# EasyEDA Pro project ProPrj_OpenWear Module_2024-08-07.epro

# Schematic schematic1
Create Date: 2023-11-08; Page Name: P1; Project Name: OpenWear button; Schematic Name: schematic1; Update Date: 2023-11-08; Company: 嘉立创EDA; Page Size: A4; Version: V1.0
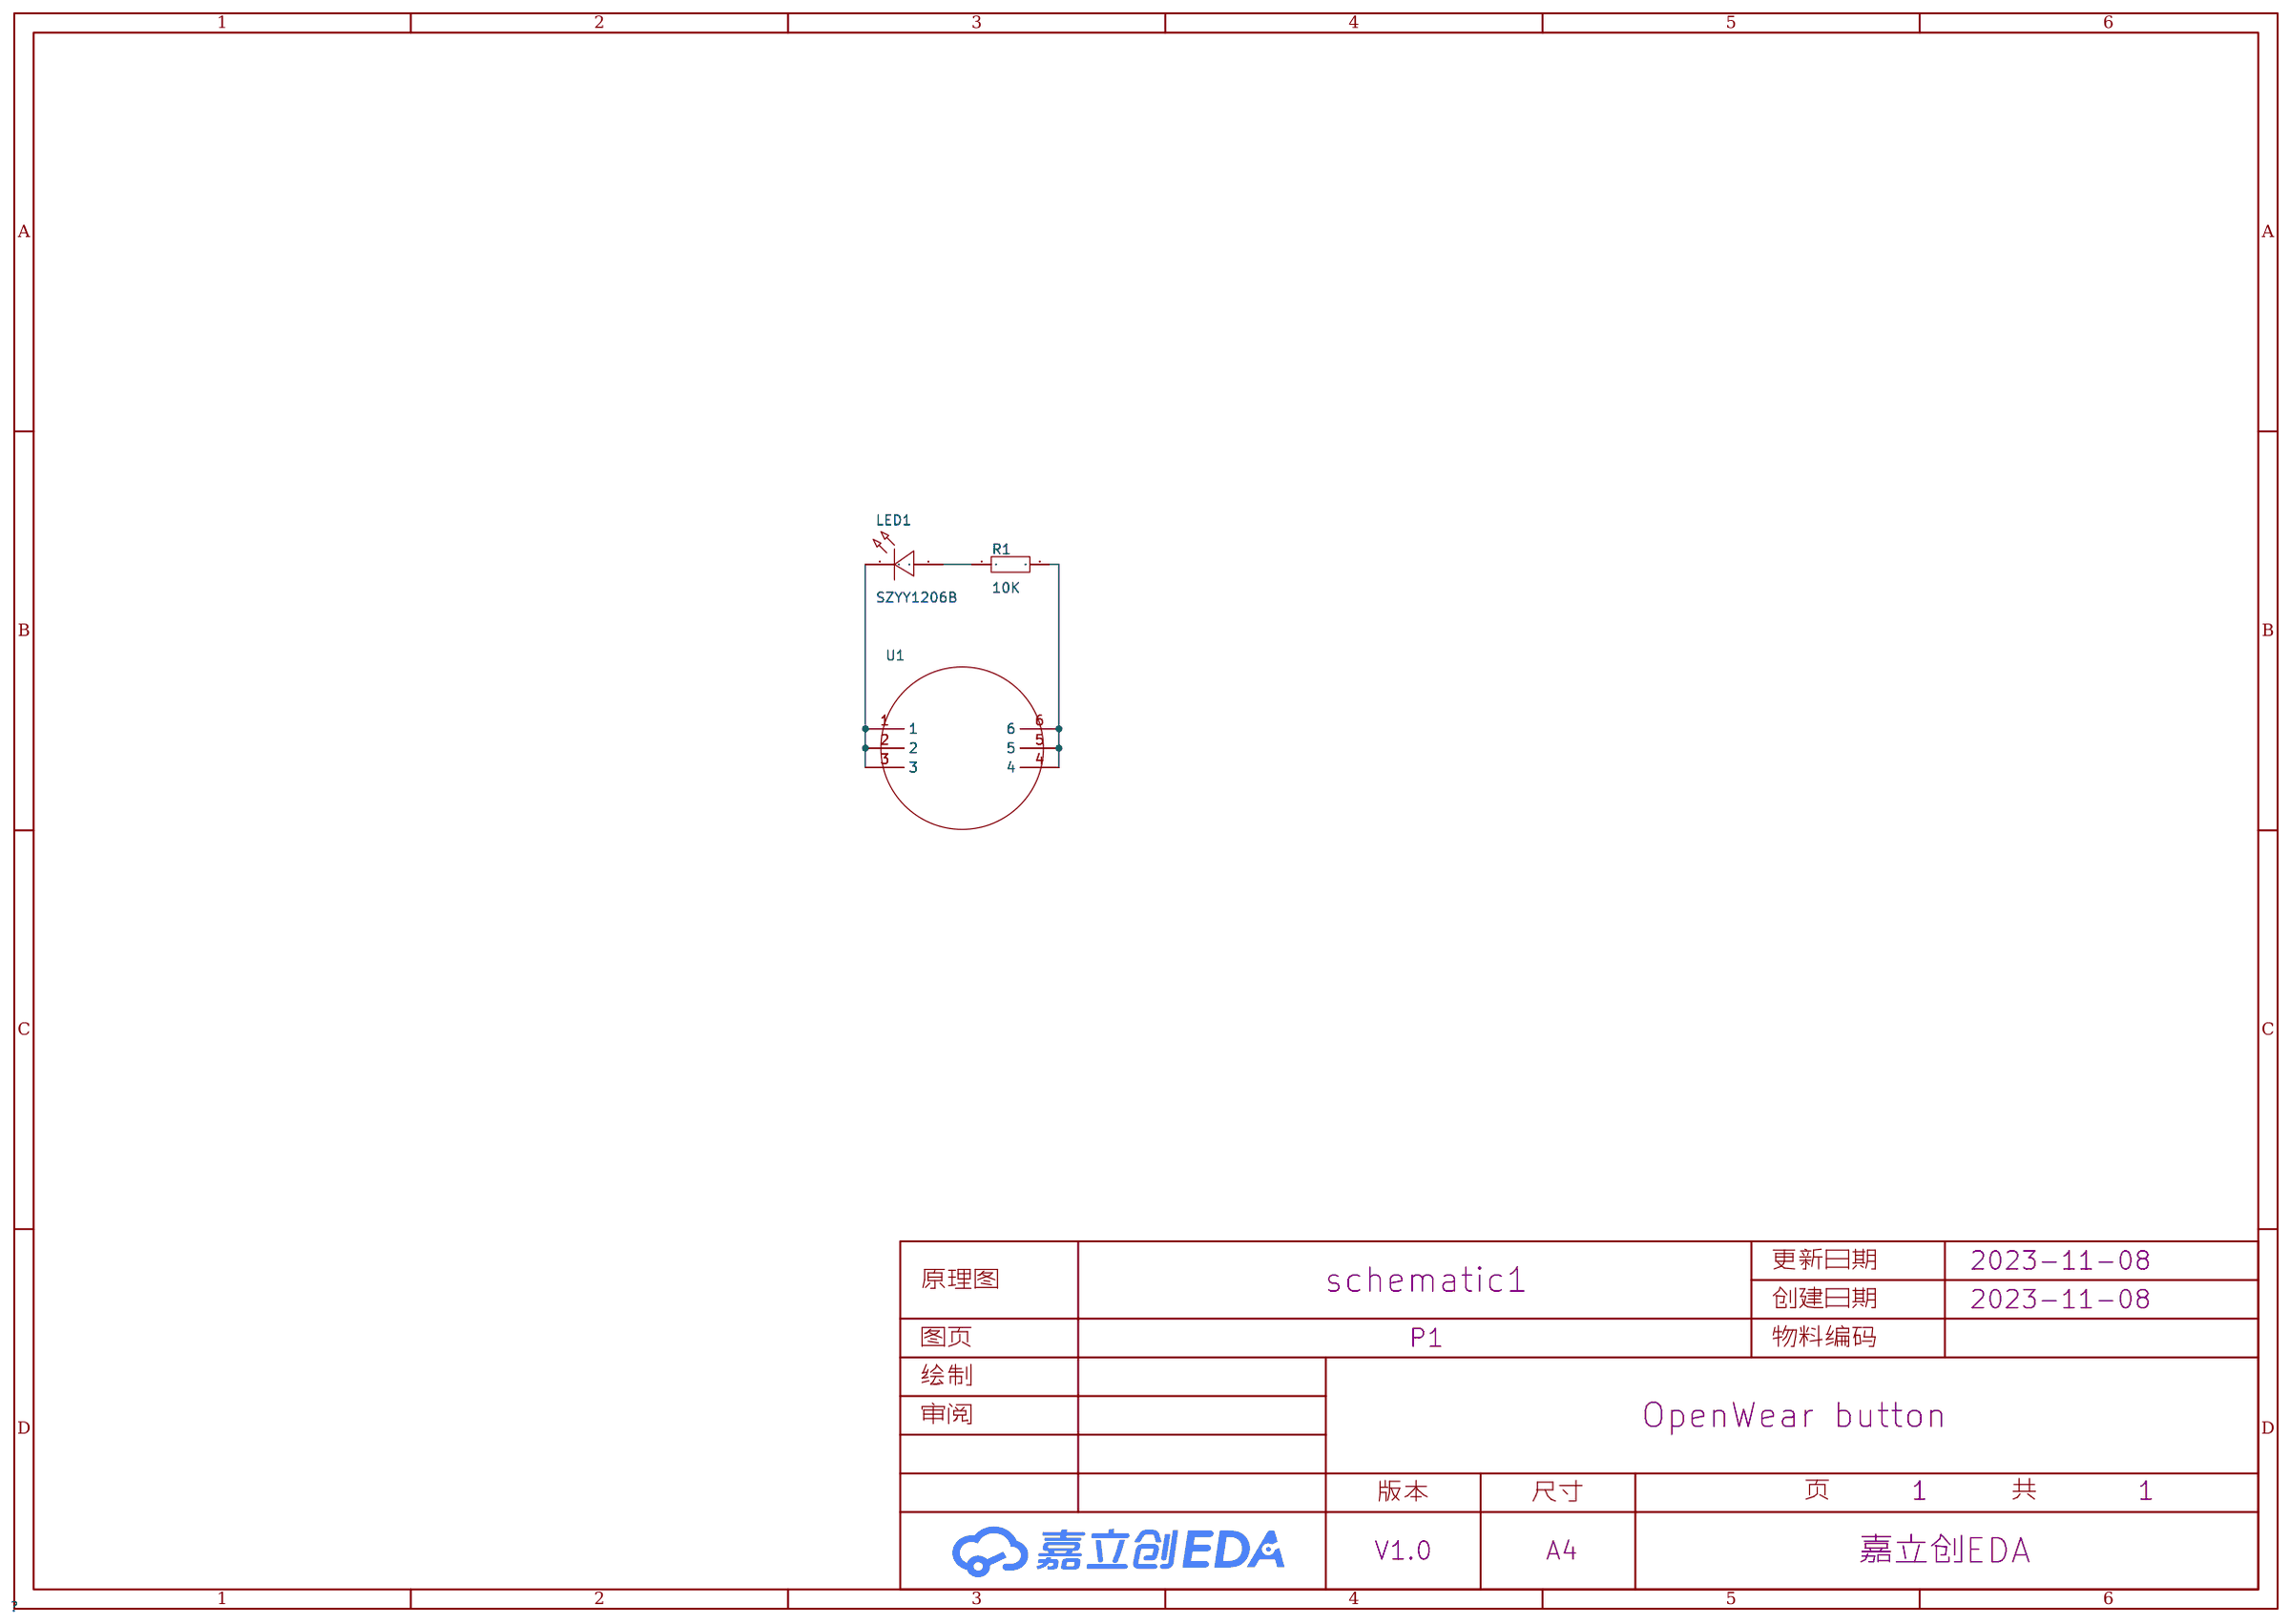
[diagram p0: schematic sheet]

## Parts
LED1  SZYY1206B  [LED1206-RD_BLUE]
R1  10K  [R0805]
U1  -  [ring-6]

## Library data of the parts
LED1 = SZYY1206B: 发光颜色:蓝灯;二极管配置:-;主波长:460nm~475nm;色温:-;功率:100mW;安装方式:-;; LCSC Part Name: 蓝灯; Supplier Part: C434440; Manufacturer: yongyu(永裕光电); Supplier Footprint: 1206; Datasheet: https://atta.szlcsc.com/upload/public/pdf/source/20200628/C434440_4695B106742D2A5A4116465A96970157.pdf; Supplier: LCSC; Emitted Color: 蓝灯; Lens Color: 无色透明; Dominant Wavelength: 460nm~475nm; Peak Wavelength: 469nm; Forward Current: 5mA; Power Dissipation: 100mW; Viewing Angle: 120°; Operating Temperature: -40℃~+85℃
R1 = Res_0805: Supplier Footprint: 0805
U1 = ring-6

## Nets
$1N188: LED1.2 R1.1
$1N621: LED1.1 U1.1 U1.2 U1.3
$1N631: R1.2 U1.4 U1.5 U1.6

# Schematic schematic1_2
Create Date: 2023-11-08; Page Name: P1; Project Name: OpenWear button; Schematic Name: schematic1_2; Update Date: 2023-11-08; Company: 嘉立创EDA; Page Size: A4; Version: V1.0
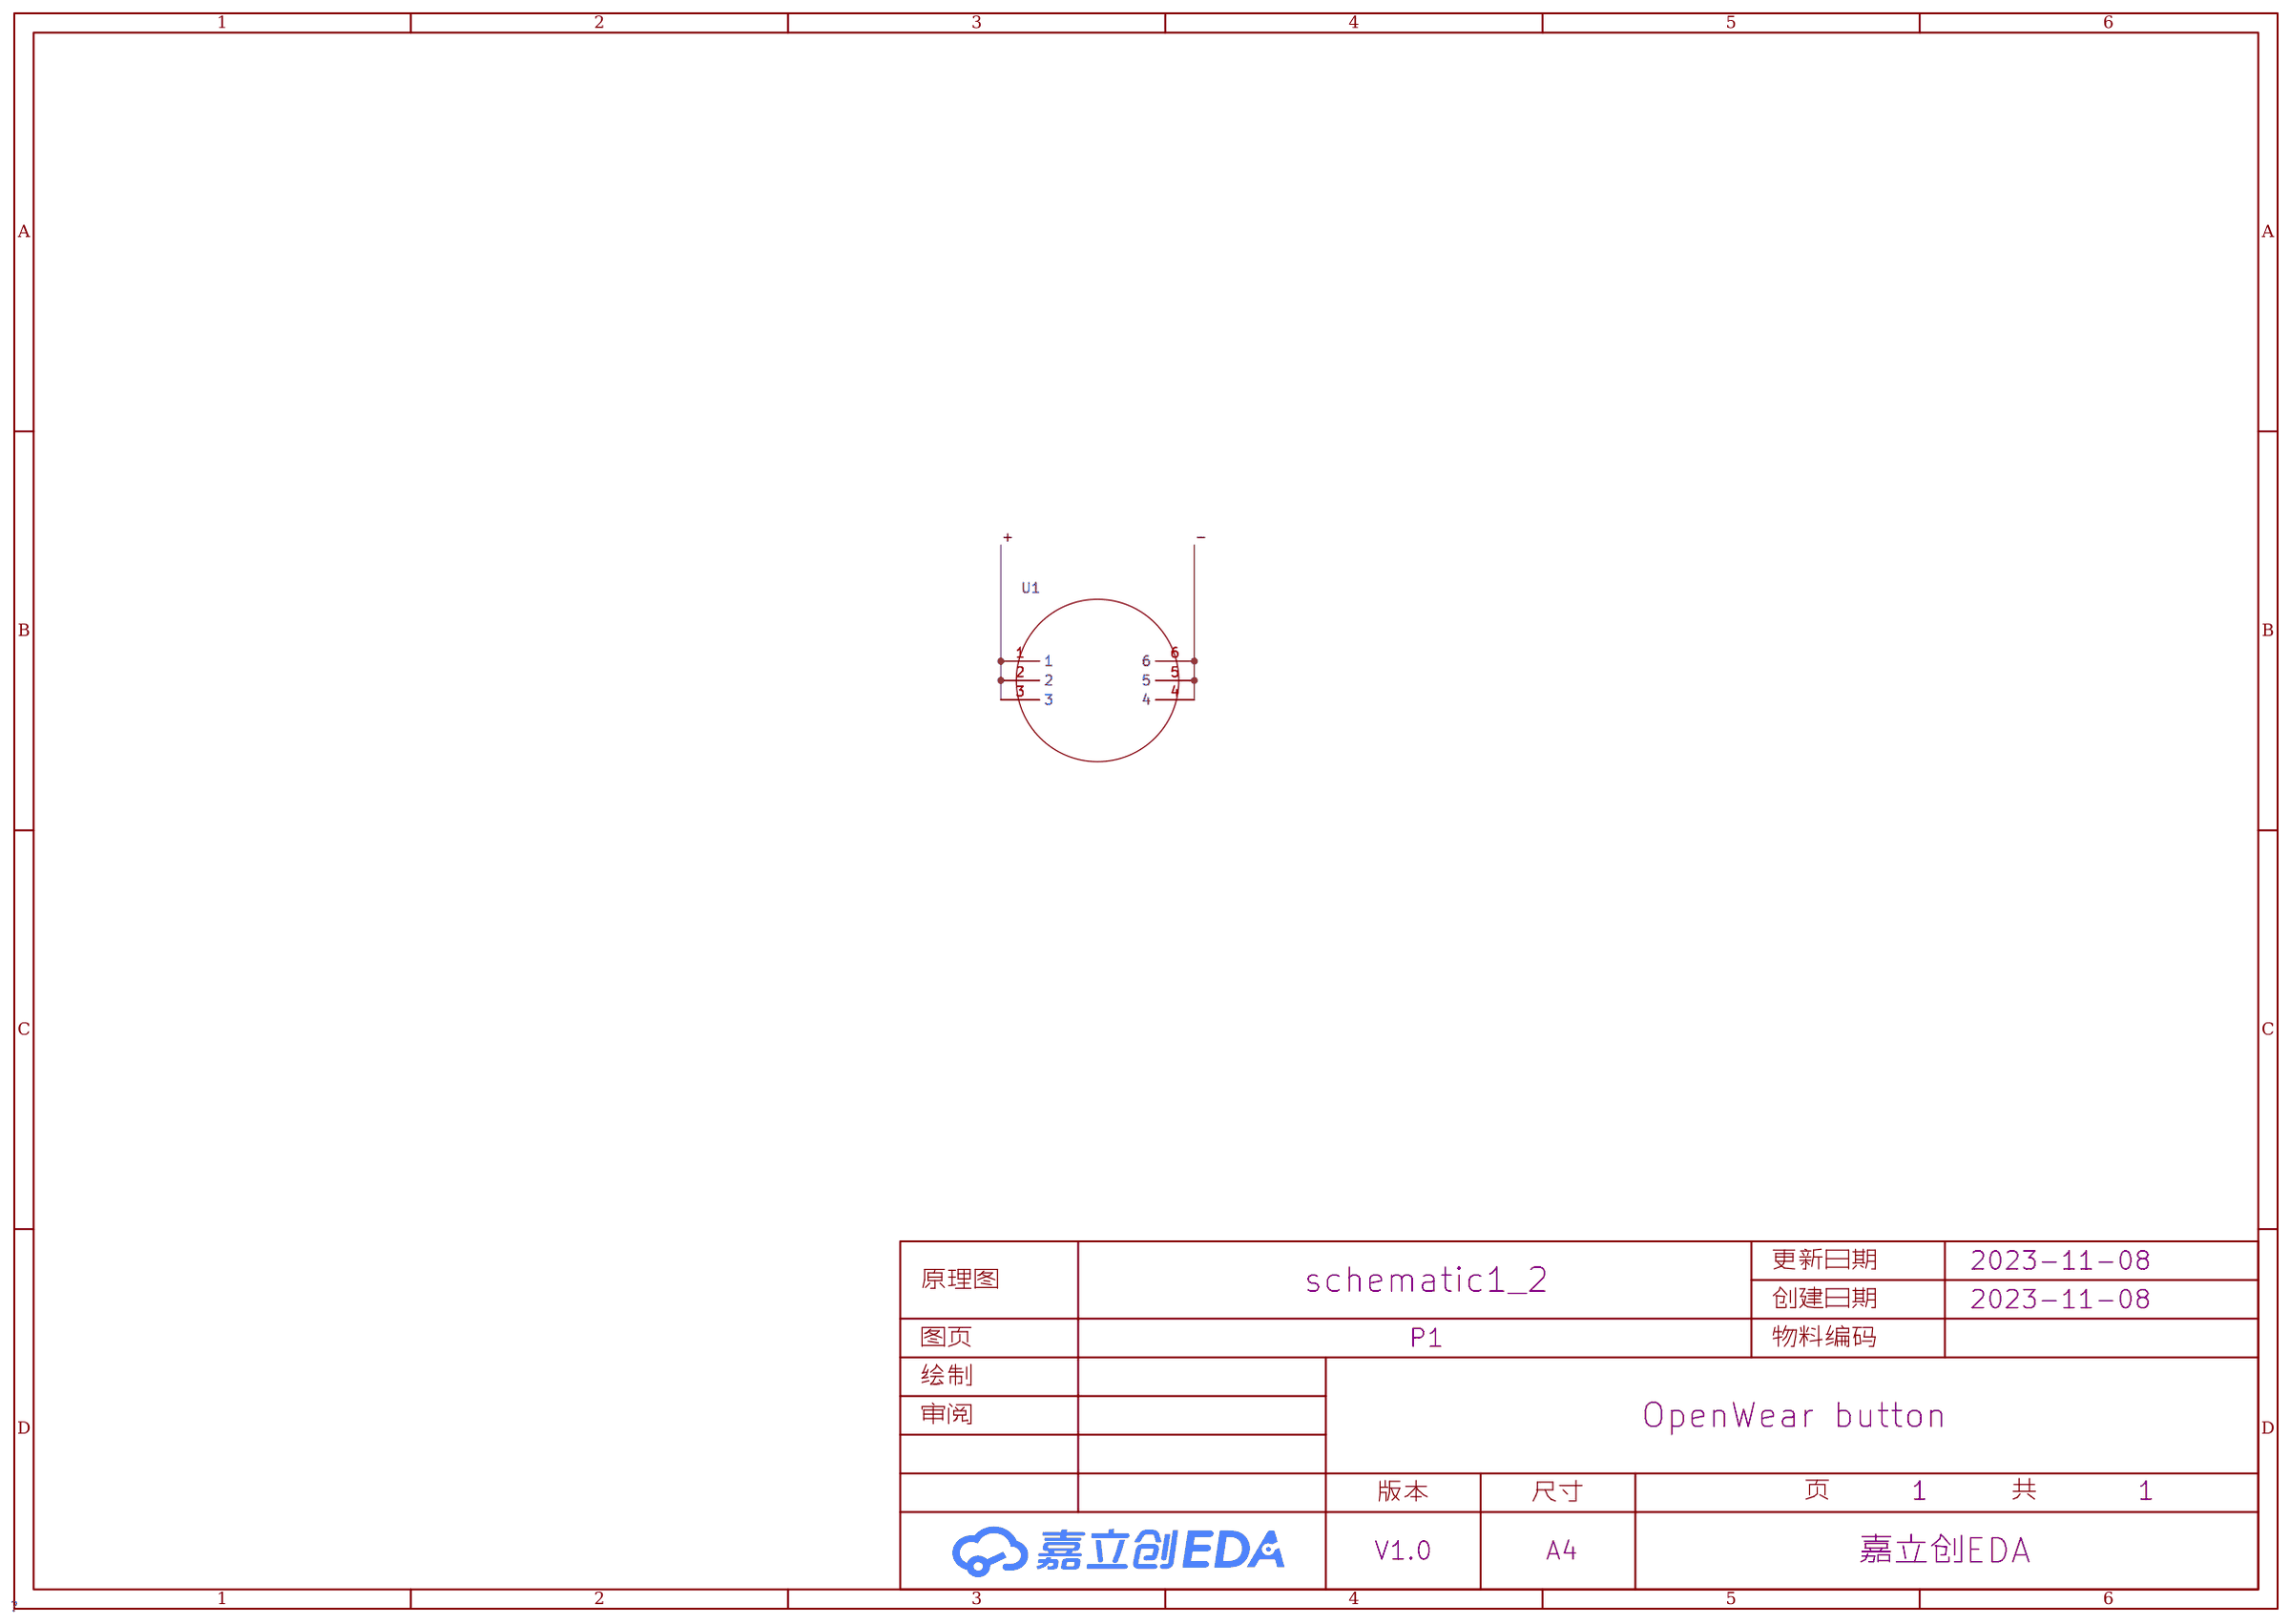
[diagram p1: schematic sheet]

## Parts
U1  -  [ring-6]

## Library data of the parts
U1 = ring-6

## Nets
+: U1.1 U1.2 U1.3
-: U1.4 U1.5 U1.6

# Schematic schematic1_3
Create Date: 2023-11-08; Page Name: P1; Project Name: OpenWear button; Schematic Name: schematic1_3; Update Date: 2023-11-08; Company: 嘉立创EDA; Page Size: A4; Version: V1.0
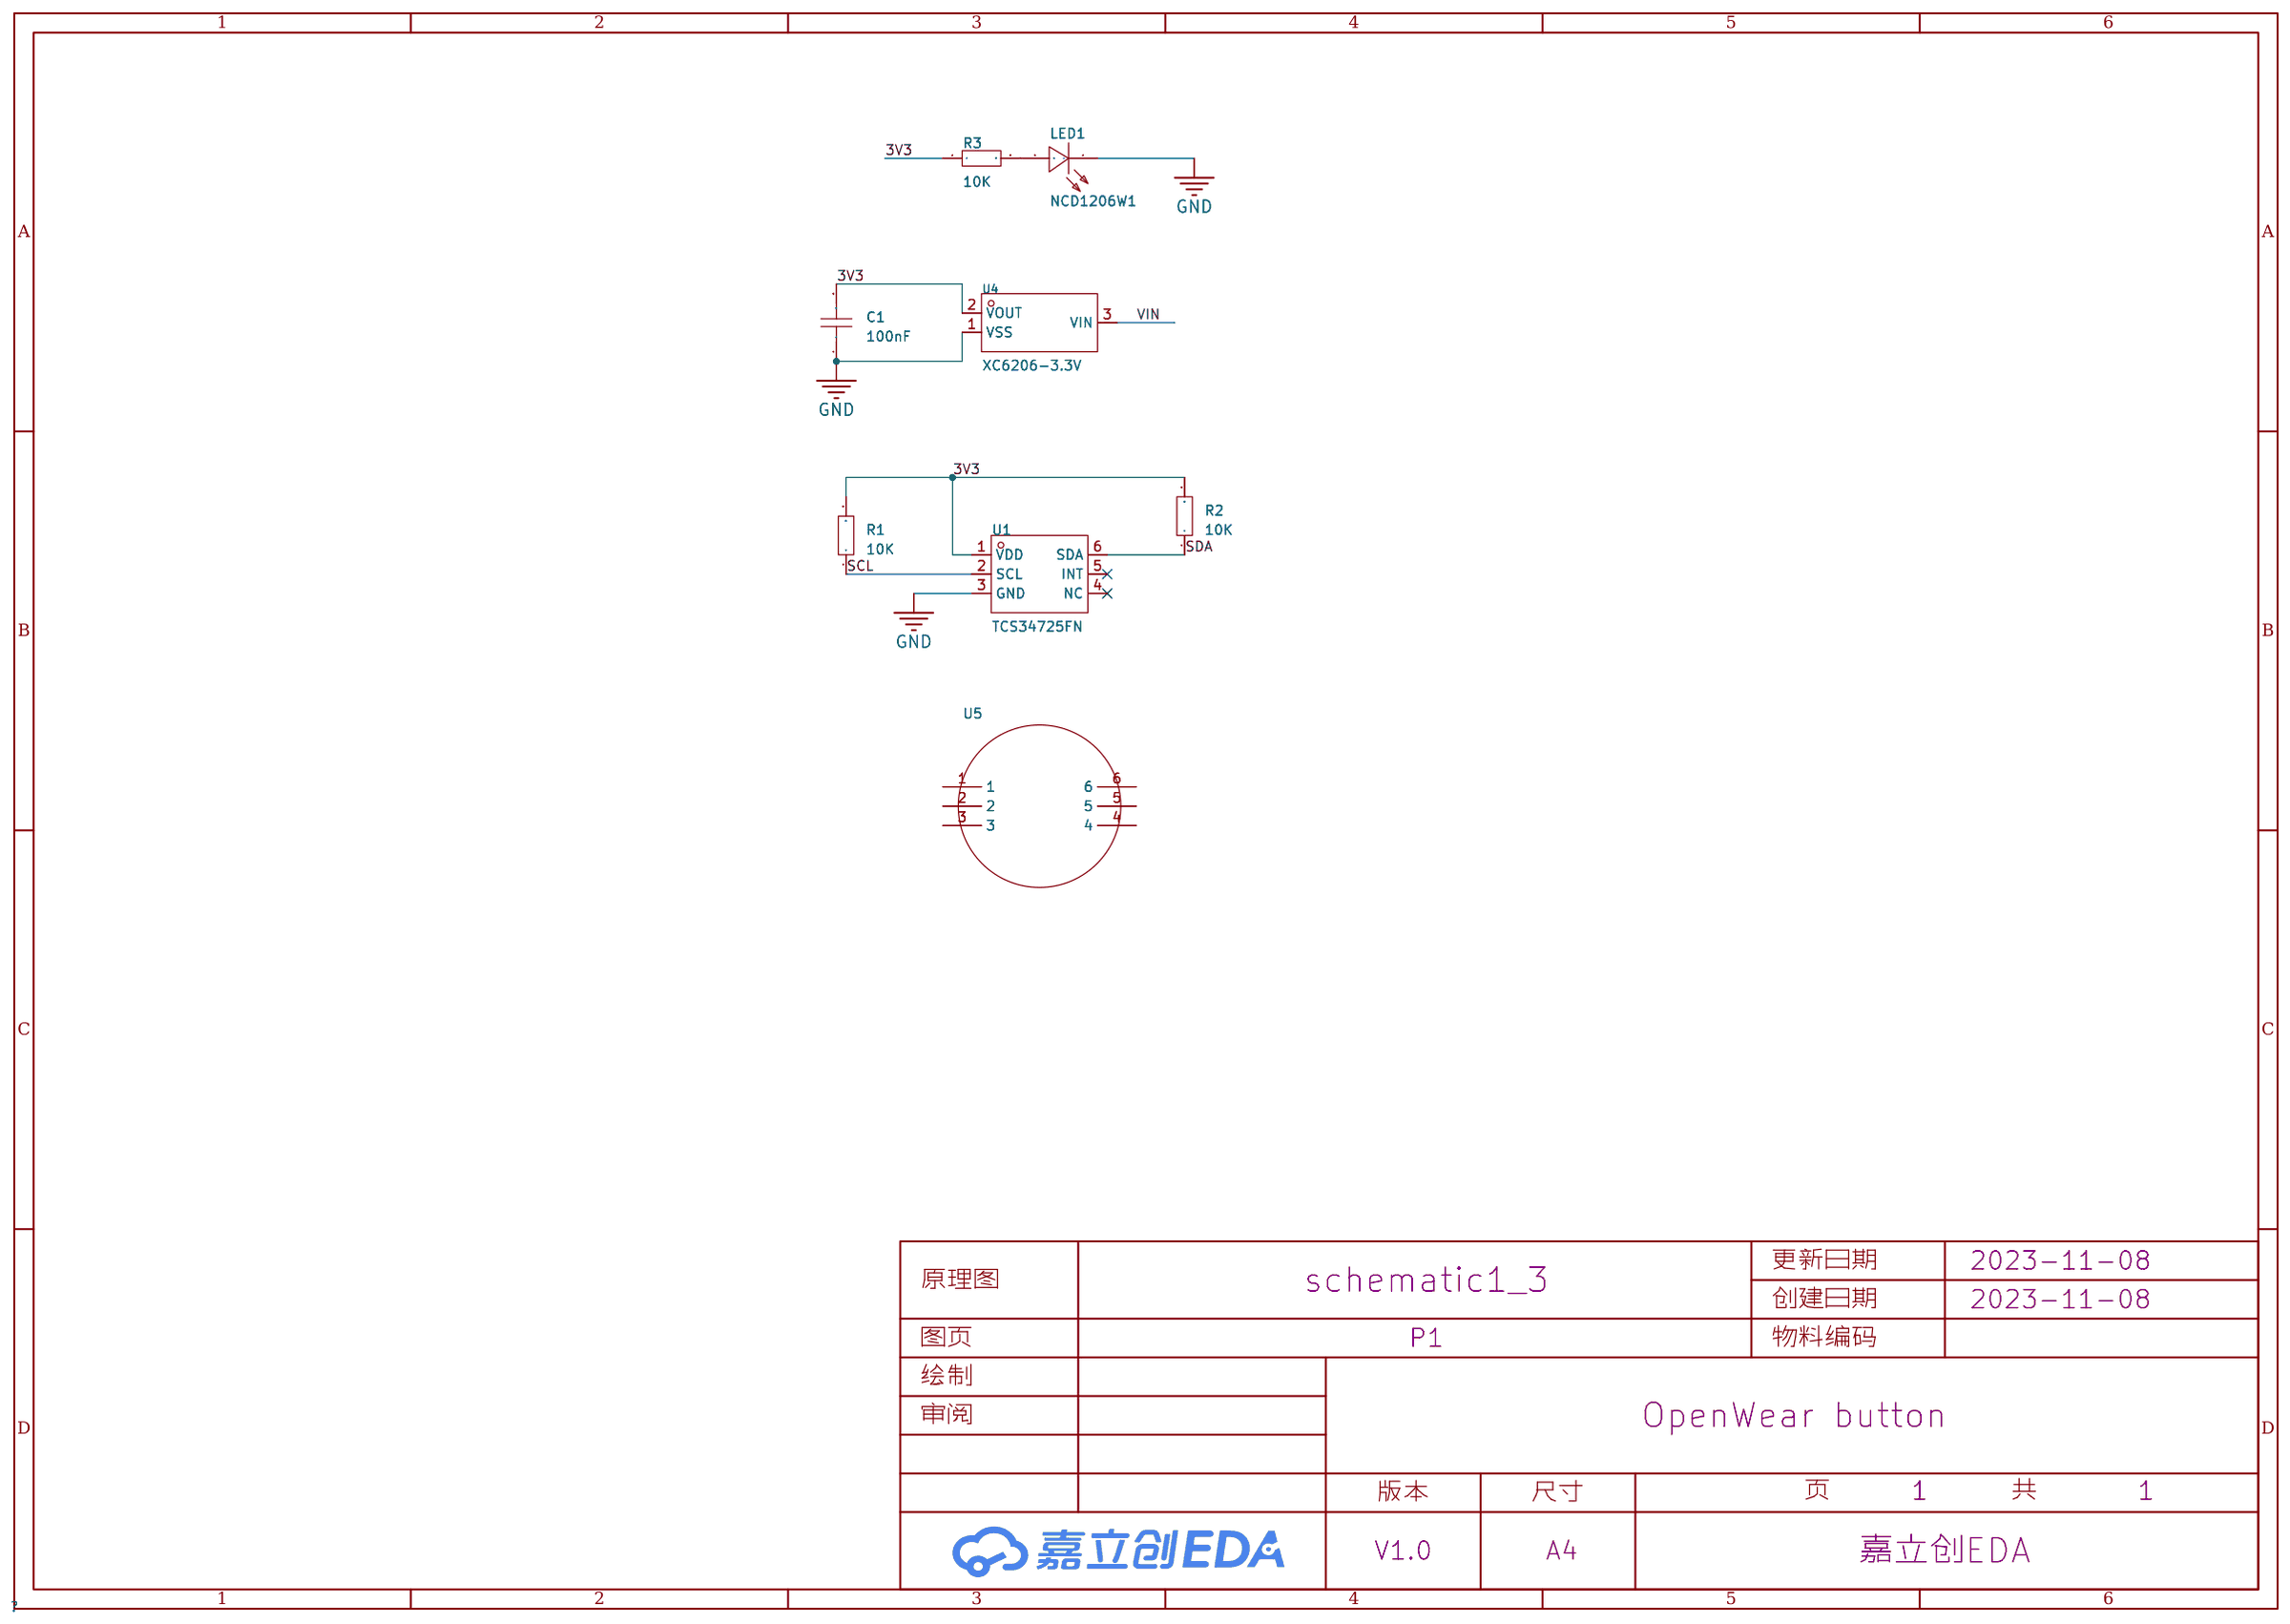
[diagram p2: schematic sheet]

## Parts
C1  100nF  [C0603]
LED1  NCD1206W1  [LED-SMD_L3.2-W1.5-RD]
R1  10K  [R0603]
R2  10K  [R0603]
R3  10K  [R0603]
U1  TCS34725FN  [SENSOR-SMD_TCS34725FN]
U4  XC6206-3.3V  [SOT-23-3_L2.9-W1.3-P0.95-LS2.4-BR]
U5  -  [ring-6]

## Library data of the parts
C1 = CAP_0603: Supplier Footprint: 0603
LED1 = NCD1206W1: 发光颜色:白色;功率:72mW;透镜颜色:雾状黄;发光强度:150mcd~275mcd;发光角度:130°;工作温度:-30℃~+85℃;; LCSC Part Name: 白灯 1206白灯    正贴; Supplier Part: C130718; Manufacturer: 国星光电; Supplier Footprint: 1206; Datasheet: https://atta.szlcsc.com/upload/public/pdf/source/20200820/C130718_782BF514D8D87EACEF7DF572B475B1BB.pdf; Supplier: LCSC; Emitted Color: 白色; Forward Voltage (VF): 2.6V~3.6V; Forward Current: 5mA; Power Dissipation: 72mW; Lens Color: 雾状黄; Luminous Intensity: 150mcd~275mcd; Viewing Angle: 130°; Operating Temperature: -30℃~+85℃
R1-R3 = Res_0603: Supplier Footprint: 0603
U1 = TCS34725FN: 分辨率(位):16;; Supplier Part: C2649487; Manufacturer: ams(艾迈斯半导体); Supplier Footprint: SMD-6P; JLCPCB Part Class: 扩展库; Datasheet: https://atta.szlcsc.com/upload/public/pdf/source/20210607/A894267B7ECC0FB945715B210CBD7250.pdf; Supplier: LCSC; Supply Voltage: 2.7V~3.6V; Resolution: 16; Operating Temperature: -30℃~+70℃
U4 = XC6206-3.3V_C7603199: 输出类型:固定;输出极性:正;最大输入电压:6V;输出电压:3.3V;输出电流:250mA;电源纹波抑制比(PSRR):-;; Supplier Part: C7603199; Manufacturer: KUU; Supplier Footprint: SOT-23; Datasheet: https://atta.szlcsc.com/upload/public/pdf/source/20230906/3CE080927AAB6AA2CDC05E5D25A8DE02.pdf; Supplier: LCSC; Output Type: 固定; Output Polarity: 正; Number of Outputs: 1; Maximum Input Voltage: 6V; Output Voltage: 3.3V; Output Current: 250mA; Operating Temperature: -25℃~+125℃@(Tj)
U5 = ring-6

## Nets
3V3: C1.2 R1.2 R2.2 R3.1 U1.1(VDD) U4.2(VOUT)
GND: C1.1 LED1.1(-) U1.3(GND) U4.1(VSS)
VIN: U4.3(VIN)
SCL: R1.1 U1.2(SCL)
SDA: R2.1 U1.6(SDA)
$1N602: LED1.2(+) R3.2

Not connected (* = marked no-connect by the designer): U1 4(NC)* 5(INT)*; U5 1 2 3 4 5 6

# Schematic schematic1_4
Create Date: 2023-11-08; Page Name: P1; Project Name: OpenWear button; Schematic Name: schematic1_4; Update Date: 2023-11-08; Company: 嘉立创EDA; Page Size: A4; Version: V1.0
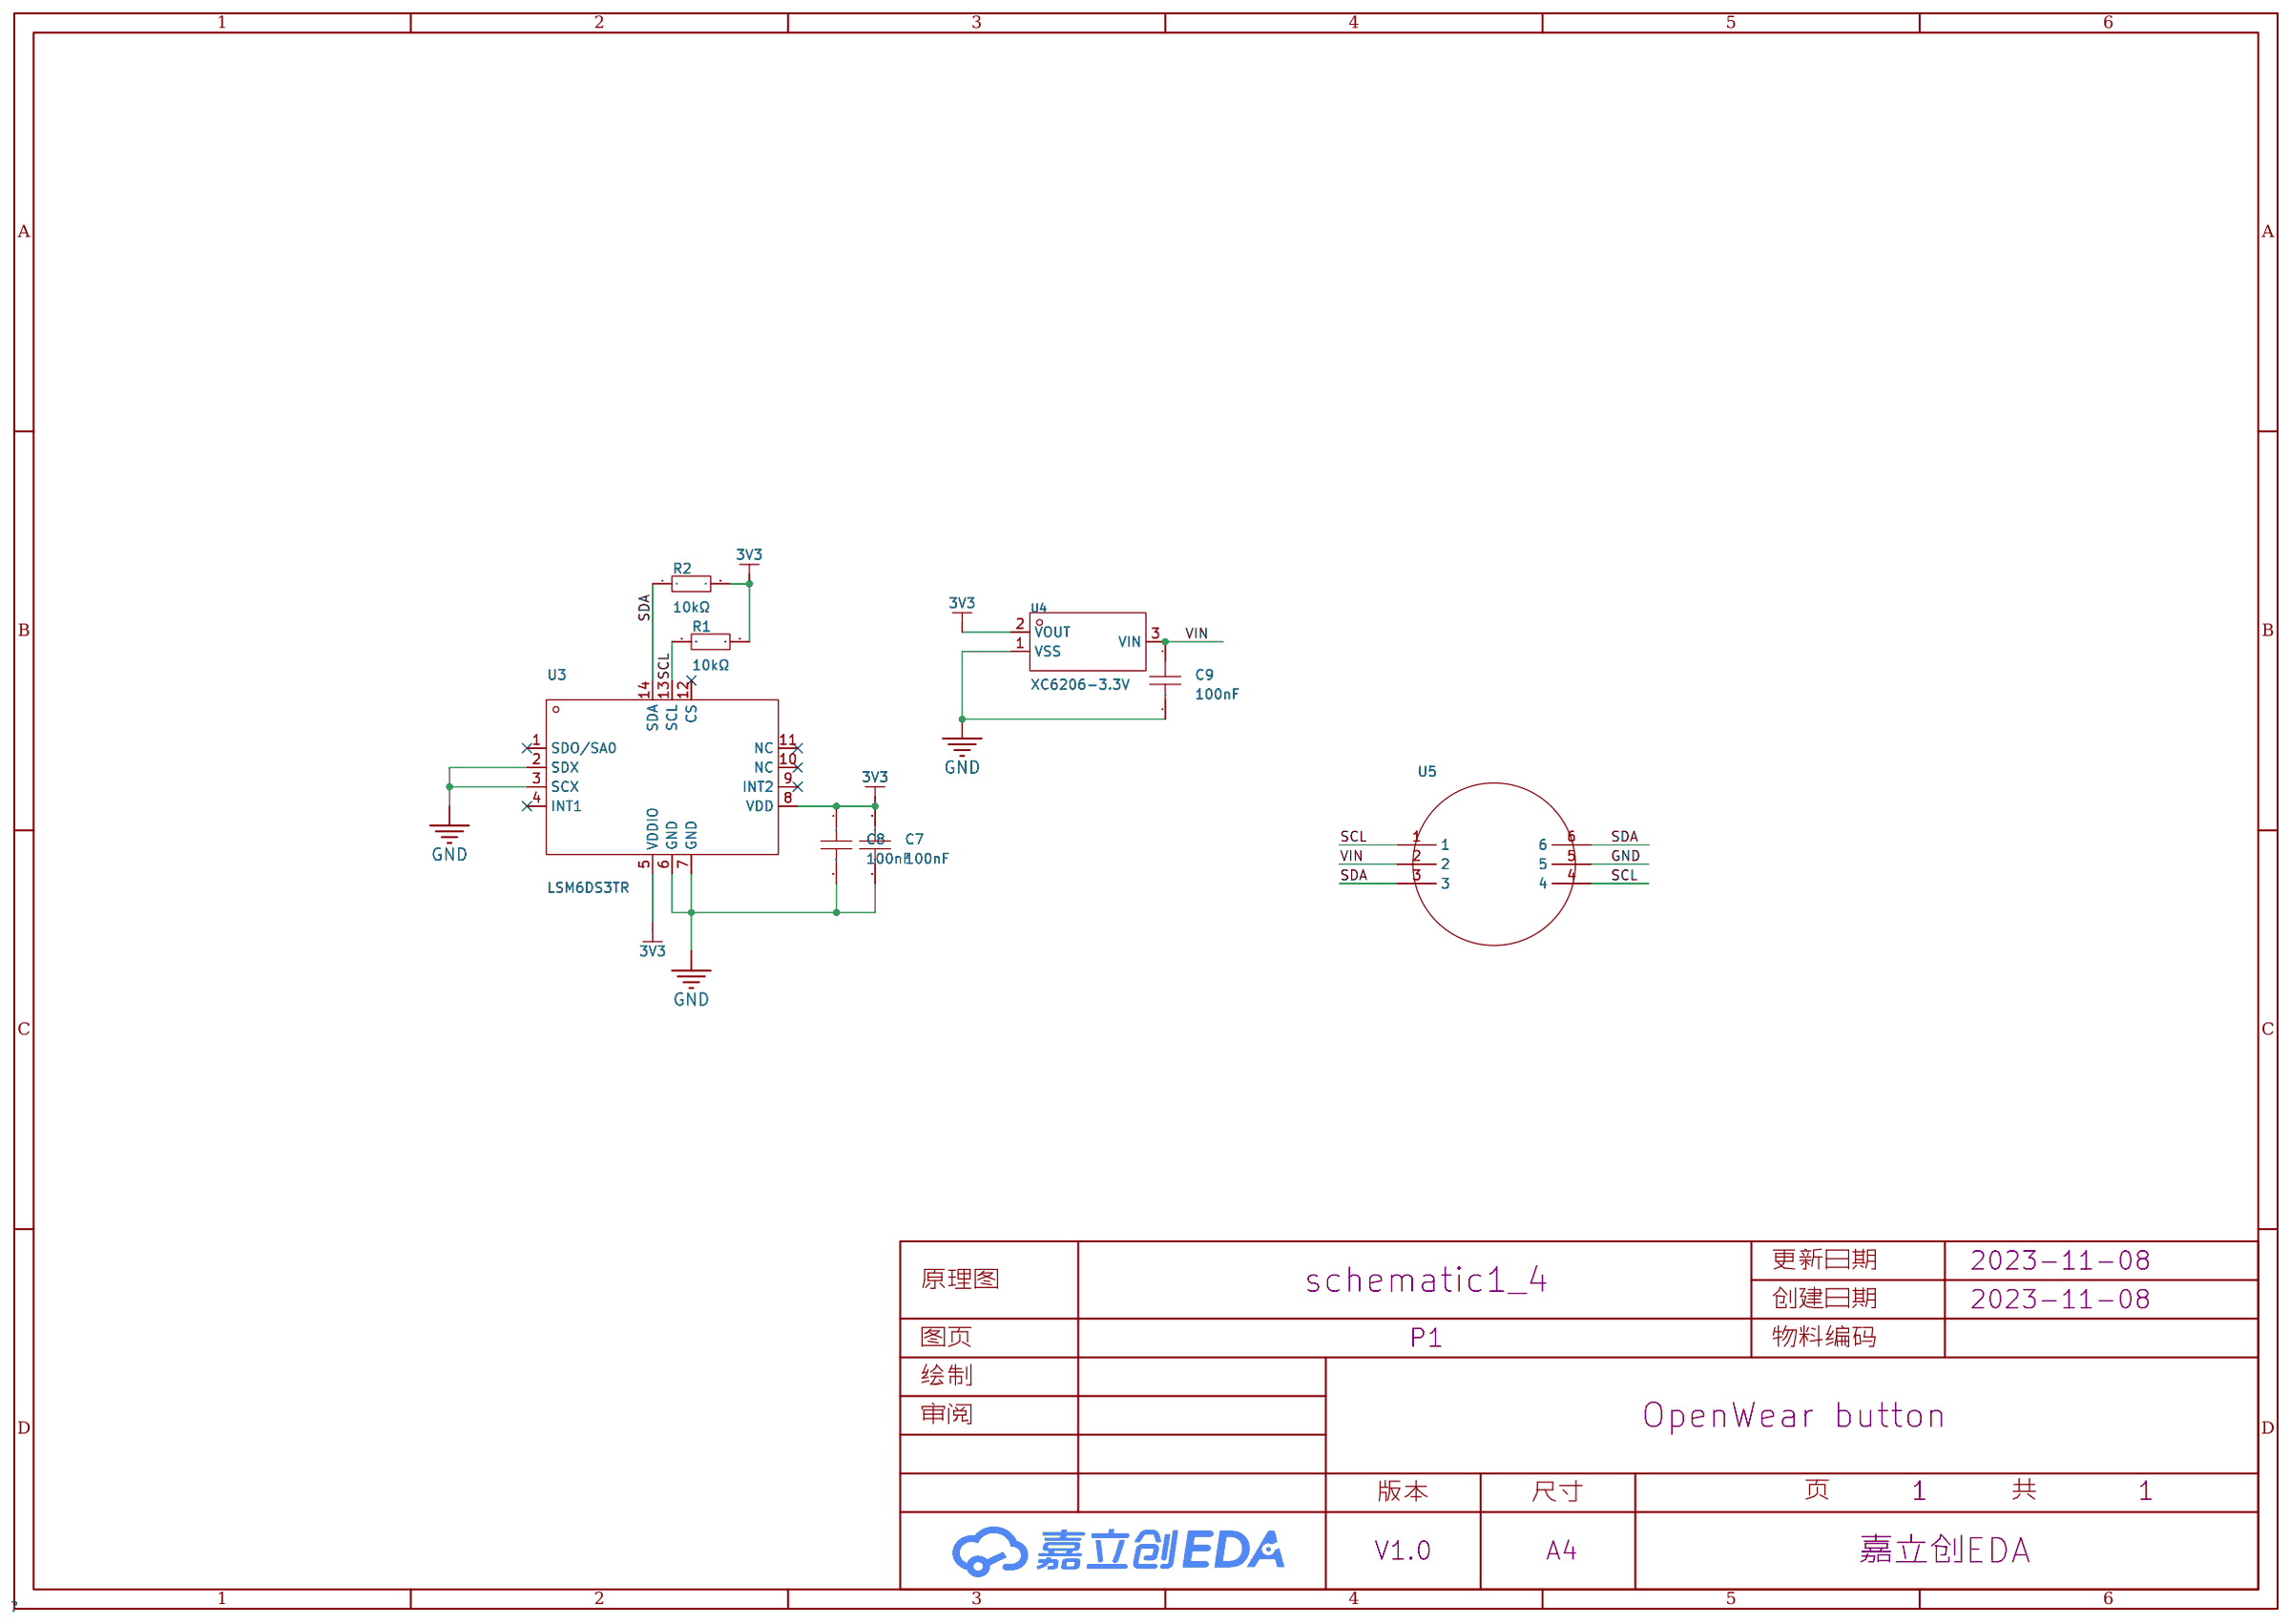
[diagram p3: schematic sheet]

## Parts
C7  100nF  [C0603]
C8  100nF  [C0603]
C9  100nF  [C0603]
R1  10kΩ  [R0603]
R2  10kΩ  [R0603]
U3  LSM6DS3TR  [LGA-14_L3.0-W2.5-P0.50-TL]
U4  XC6206-3.3V  [SOT-23-3_L2.9-W1.3-P0.95-LS2.4-BR]
U5  -  [ring-6]

## Library data of the parts
C7-C9 = 0603B104K500NT: 容值:100nF;精度:±10%;额定电压:50V;材质(温度系数):X7R;; LCSC Part Name: 100nF ±10% 50V; Supplier Part: C30926; Manufacturer: FH(风华); Supplier Footprint: 0603; JLCPCB Part Class: Extended Part; Datasheet: https://atta.szlcsc.com/upload/public/pdf/source/20170923/C30926_1506149436298988724.pdf; Supplier: LCSC; Tolerance: ±10%; Voltage Rated: 50V; Temperature Coefficient: X7R
R1 R2 = 0603WAF1002T5E: 电阻类型:厚膜电阻;阻值:10kΩ;精度:±1%;功率:100mW;; LCSC Part Name: 厚膜电阻 10kΩ ±1% 100mW; Supplier Part: C25804; Manufacturer: UNI-ROYAL(厚声); Supplier Footprint: 0603; JLCPCB Part Class: Basic Part; Datasheet: https://atta.szlcsc.com/upload/public/pdf/source/20200306/C422600_1E6D84923E4A46A82E41ADD87F860B5C.pdf; Supplier: LCSC; Type: 厚膜电阻; Tolerance: ±1%; Power(Watts): 100mW; Temperature Coefficient: ±100ppm/℃; Overload Voltage (Max): 75V; Operating Temperature Range: -55℃~+155℃
U3 = LSM6DS3TR: 3D 加速度计and 3D 陀螺仪3D accelerometer and 3D gyroscope; LCSC Part Name: LSM6DS3TR MSL=3; Supplier Part: C95230; Manufacturer: ST(意法半导体); Supplier Footprint: LGA-14L; JLCPCB Part Class: 扩展库; Datasheet: https://atta.szlcsc.com/upload/public/pdf/source/20180410/C95230_E9546B888C12D8CC6F7F231B3BE24882.pdf; Supplier: LCSC
U4 = XC6206-3.3V_C7603199: 输出类型:固定;输出极性:正;最大输入电压:6V;输出电压:3.3V;输出电流:250mA;电源纹波抑制比(PSRR):-;; Supplier Part: C7603199; Manufacturer: KUU; Supplier Footprint: SOT-23; Datasheet: https://atta.szlcsc.com/upload/public/pdf/source/20230906/3CE080927AAB6AA2CDC05E5D25A8DE02.pdf; Supplier: LCSC; Output Type: 固定; Output Polarity: 正; Number of Outputs: 1; Maximum Input Voltage: 6V; Output Voltage: 3.3V; Output Current: 250mA; Operating Temperature: -25℃~+125℃@(Tj)
U5 = ring-6

## Nets
3V3: C7.1 C8.1 R1.2 R2.2 U3.5(VDDIO) U3.8(VDD) U4.2(VOUT)
GND: C7.2 C8.2 C9.2 U3.2(SDX) U3.3(SCX) U3.6(GND) U3.7(GND) U4.1(VSS) U5.5
VIN: C9.1 U4.3(VIN) U5.2
SCL: R1.1 U3.13(SCL) U5.1 U5.4
SDA: R2.1 U3.14(SDA) U5.3 U5.6

Not connected (* = marked no-connect by the designer): U3 1(SDO/SA0)* 4(INT1)* 9(INT2)* 10(NC)* 11(NC)* 12(CS)*

# Schematic schematic1_5
Create Date: 2023-11-08; Page Name: P1; Project Name: OpenWear button; Schematic Name: schematic1_5; Update Date: 2023-11-08; Company: 嘉立创EDA; Page Size: A4; Version: V1.0
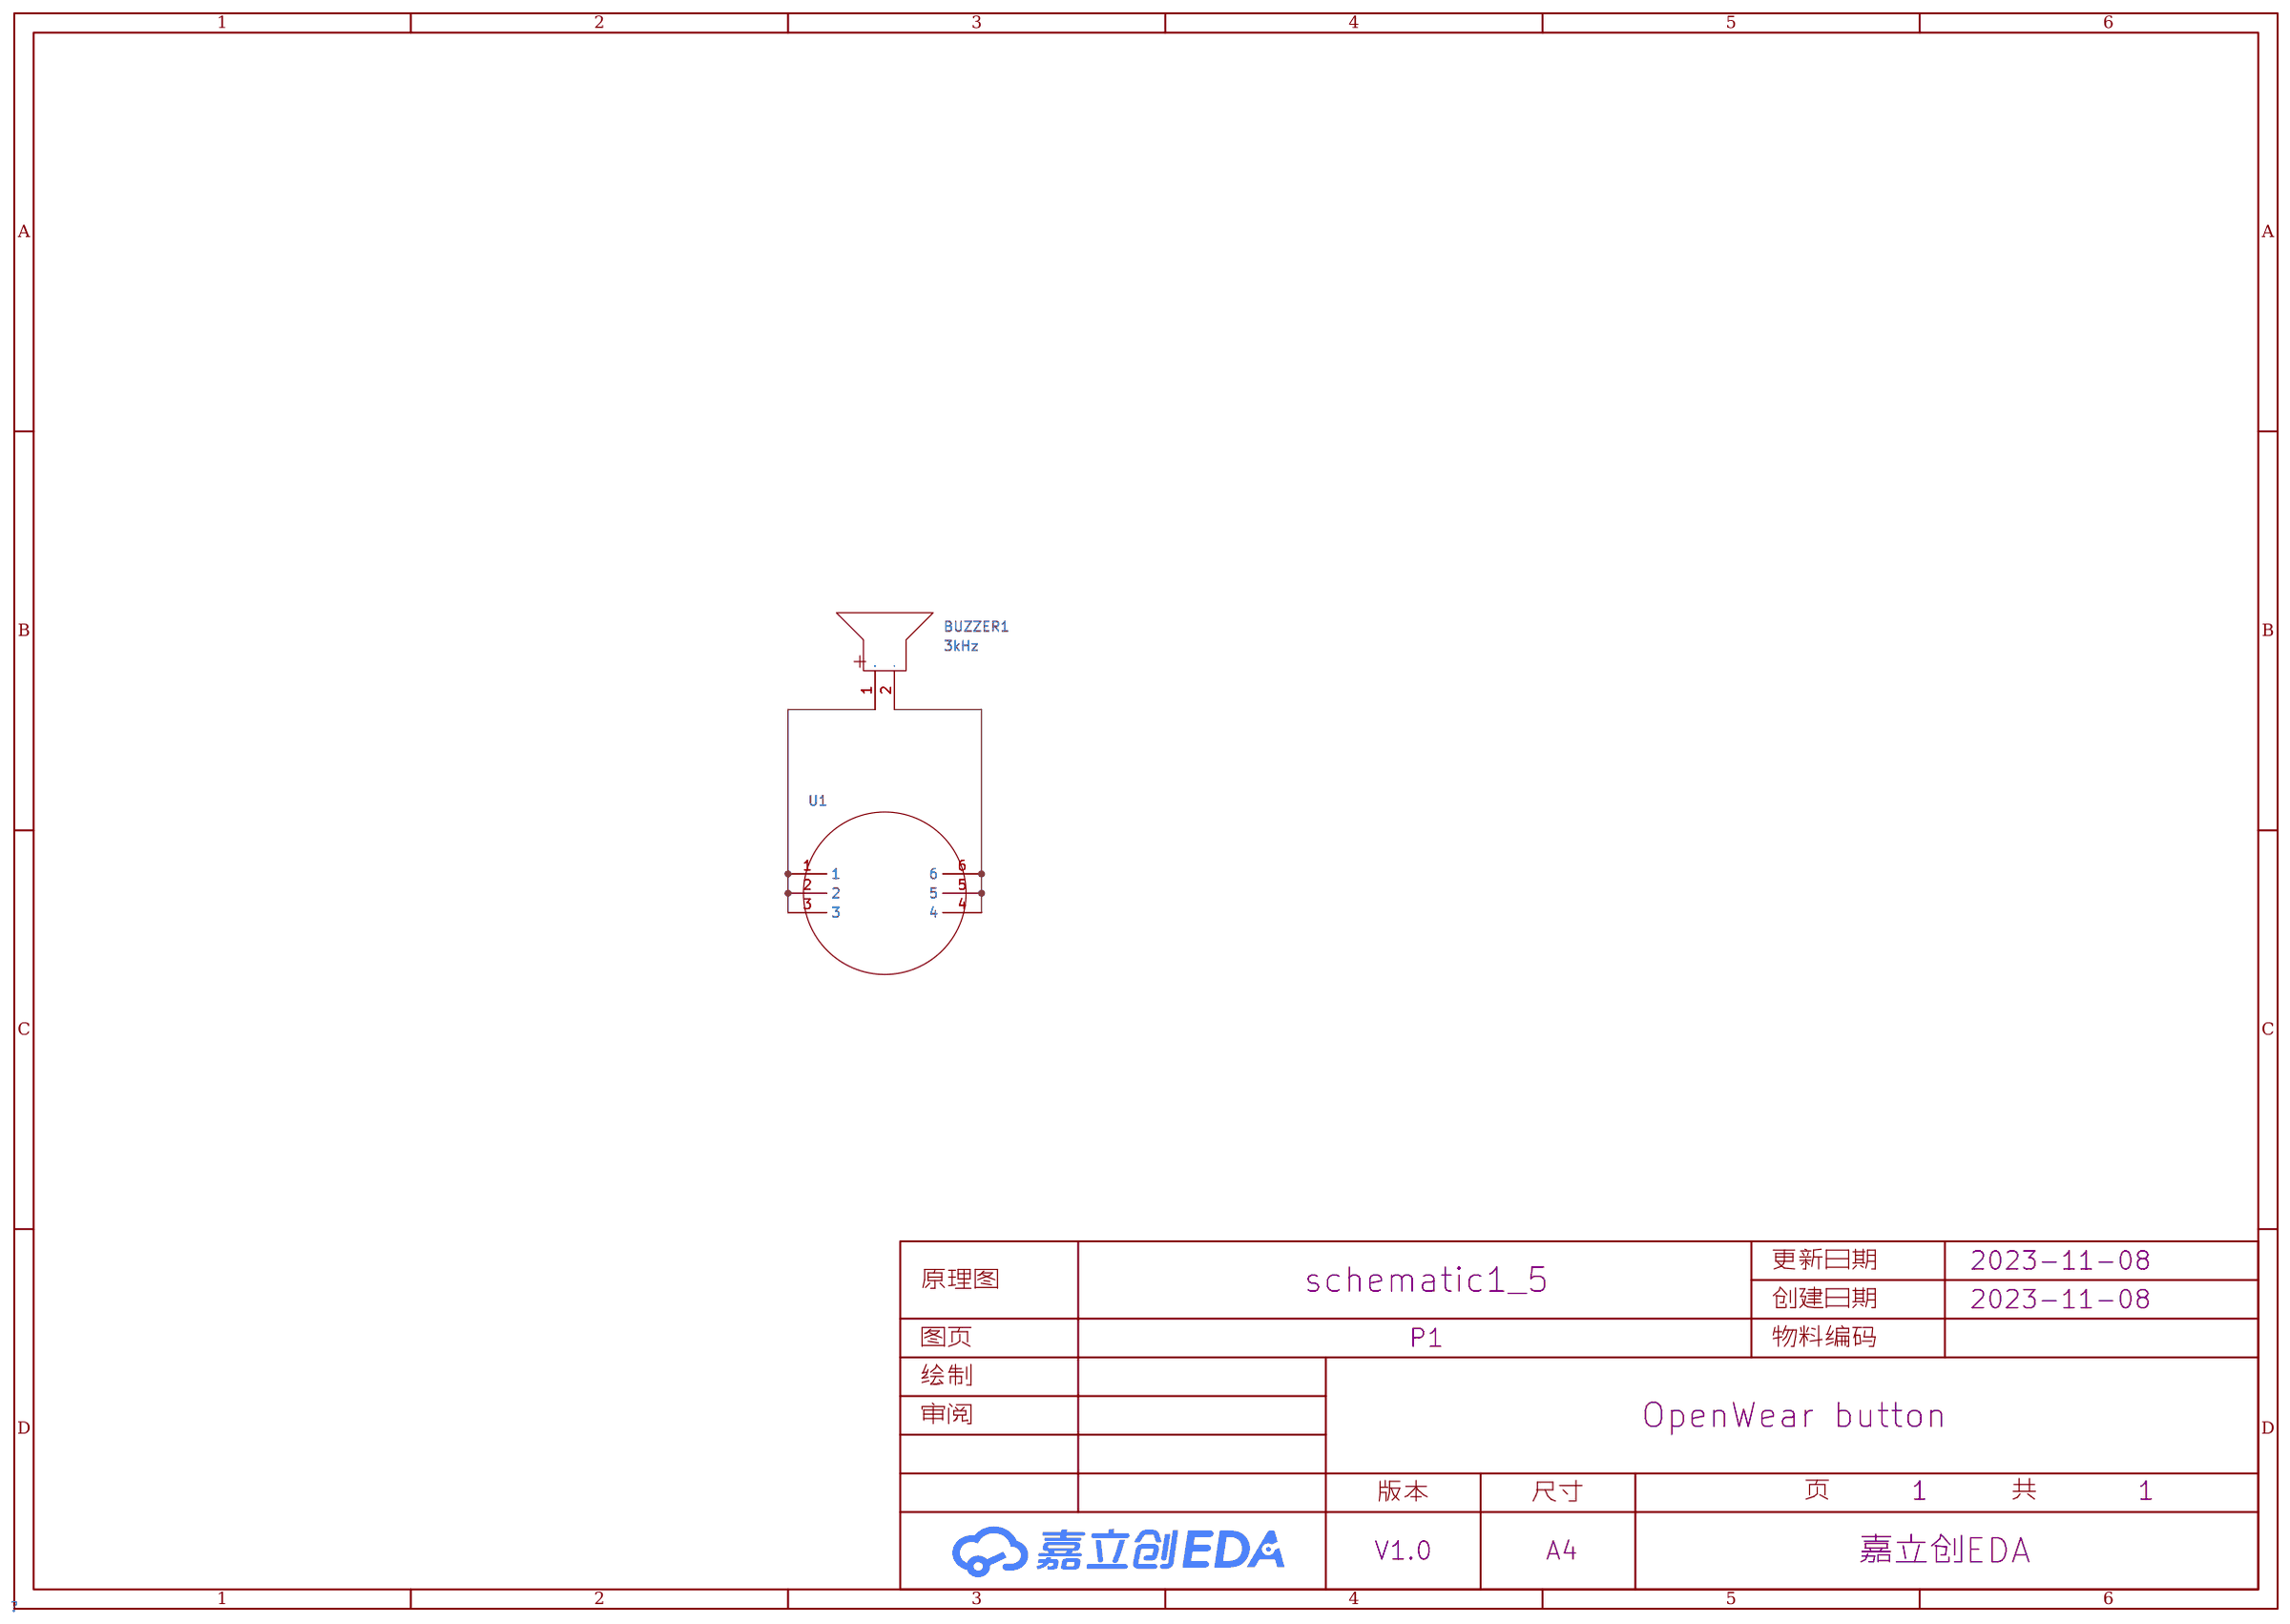
[diagram p4: schematic sheet]

## Parts
BUZZER1  3kHz  [BUZ-TH_BD9.0-P5.00-D0.6-FD]
U1  -  [ring-6]

## Library data of the parts
BUZZER1 = HNB09A03: 驱动方式:有源(内含驱动线路);构造类型:电磁式;额定电压:3V;工作电压:1.5V~4.5V;消耗电流:30mA;频率:3kHz;声压(SPL):85dB@10cm;直径(φD):9mm;长度:-;宽度:-;高度:5.5mm;工作温度:-20℃~+70℃;; LCSC Part Name: 电磁式有源一体蜂鸣器HNB09A03; Supplier Part: C96102; Manufacturer: 华能; Supplier Footprint: 插件,D=9mm; JLCPCB Part Class: 扩展库; Datasheet: https://atta.szlcsc.com/upload/public/pdf/source/20170522/1495448326172.pdf; Supplier: LCSC; Oscillator Circuit: 有源(内含驱动线路); Technology Type: 电磁式; Rated Voltage: 3V; Operating Voltage: 1.5V~4.5V; Current Consumption: 30mA; Sound Pressure Level (SPL): 85dB@10cm; Diameter (φD): 9mm; Height: 5.5mm; Operating Temperature: -20℃~+70℃
U1 = ring-6

## Nets
$1N235: BUZZER1.1(+) U1.1 U1.2 U1.3
$1N247: BUZZER1.2(-) U1.4 U1.5 U1.6

# Schematic Schematic2
Create Date: 2023-11-08; Page Name: P1; Project Name: OpenWear button; Schematic Name: Schematic2; Update Date: 2023-12-05; Company: 嘉立创EDA; Page Size: A4; Version: V1.0
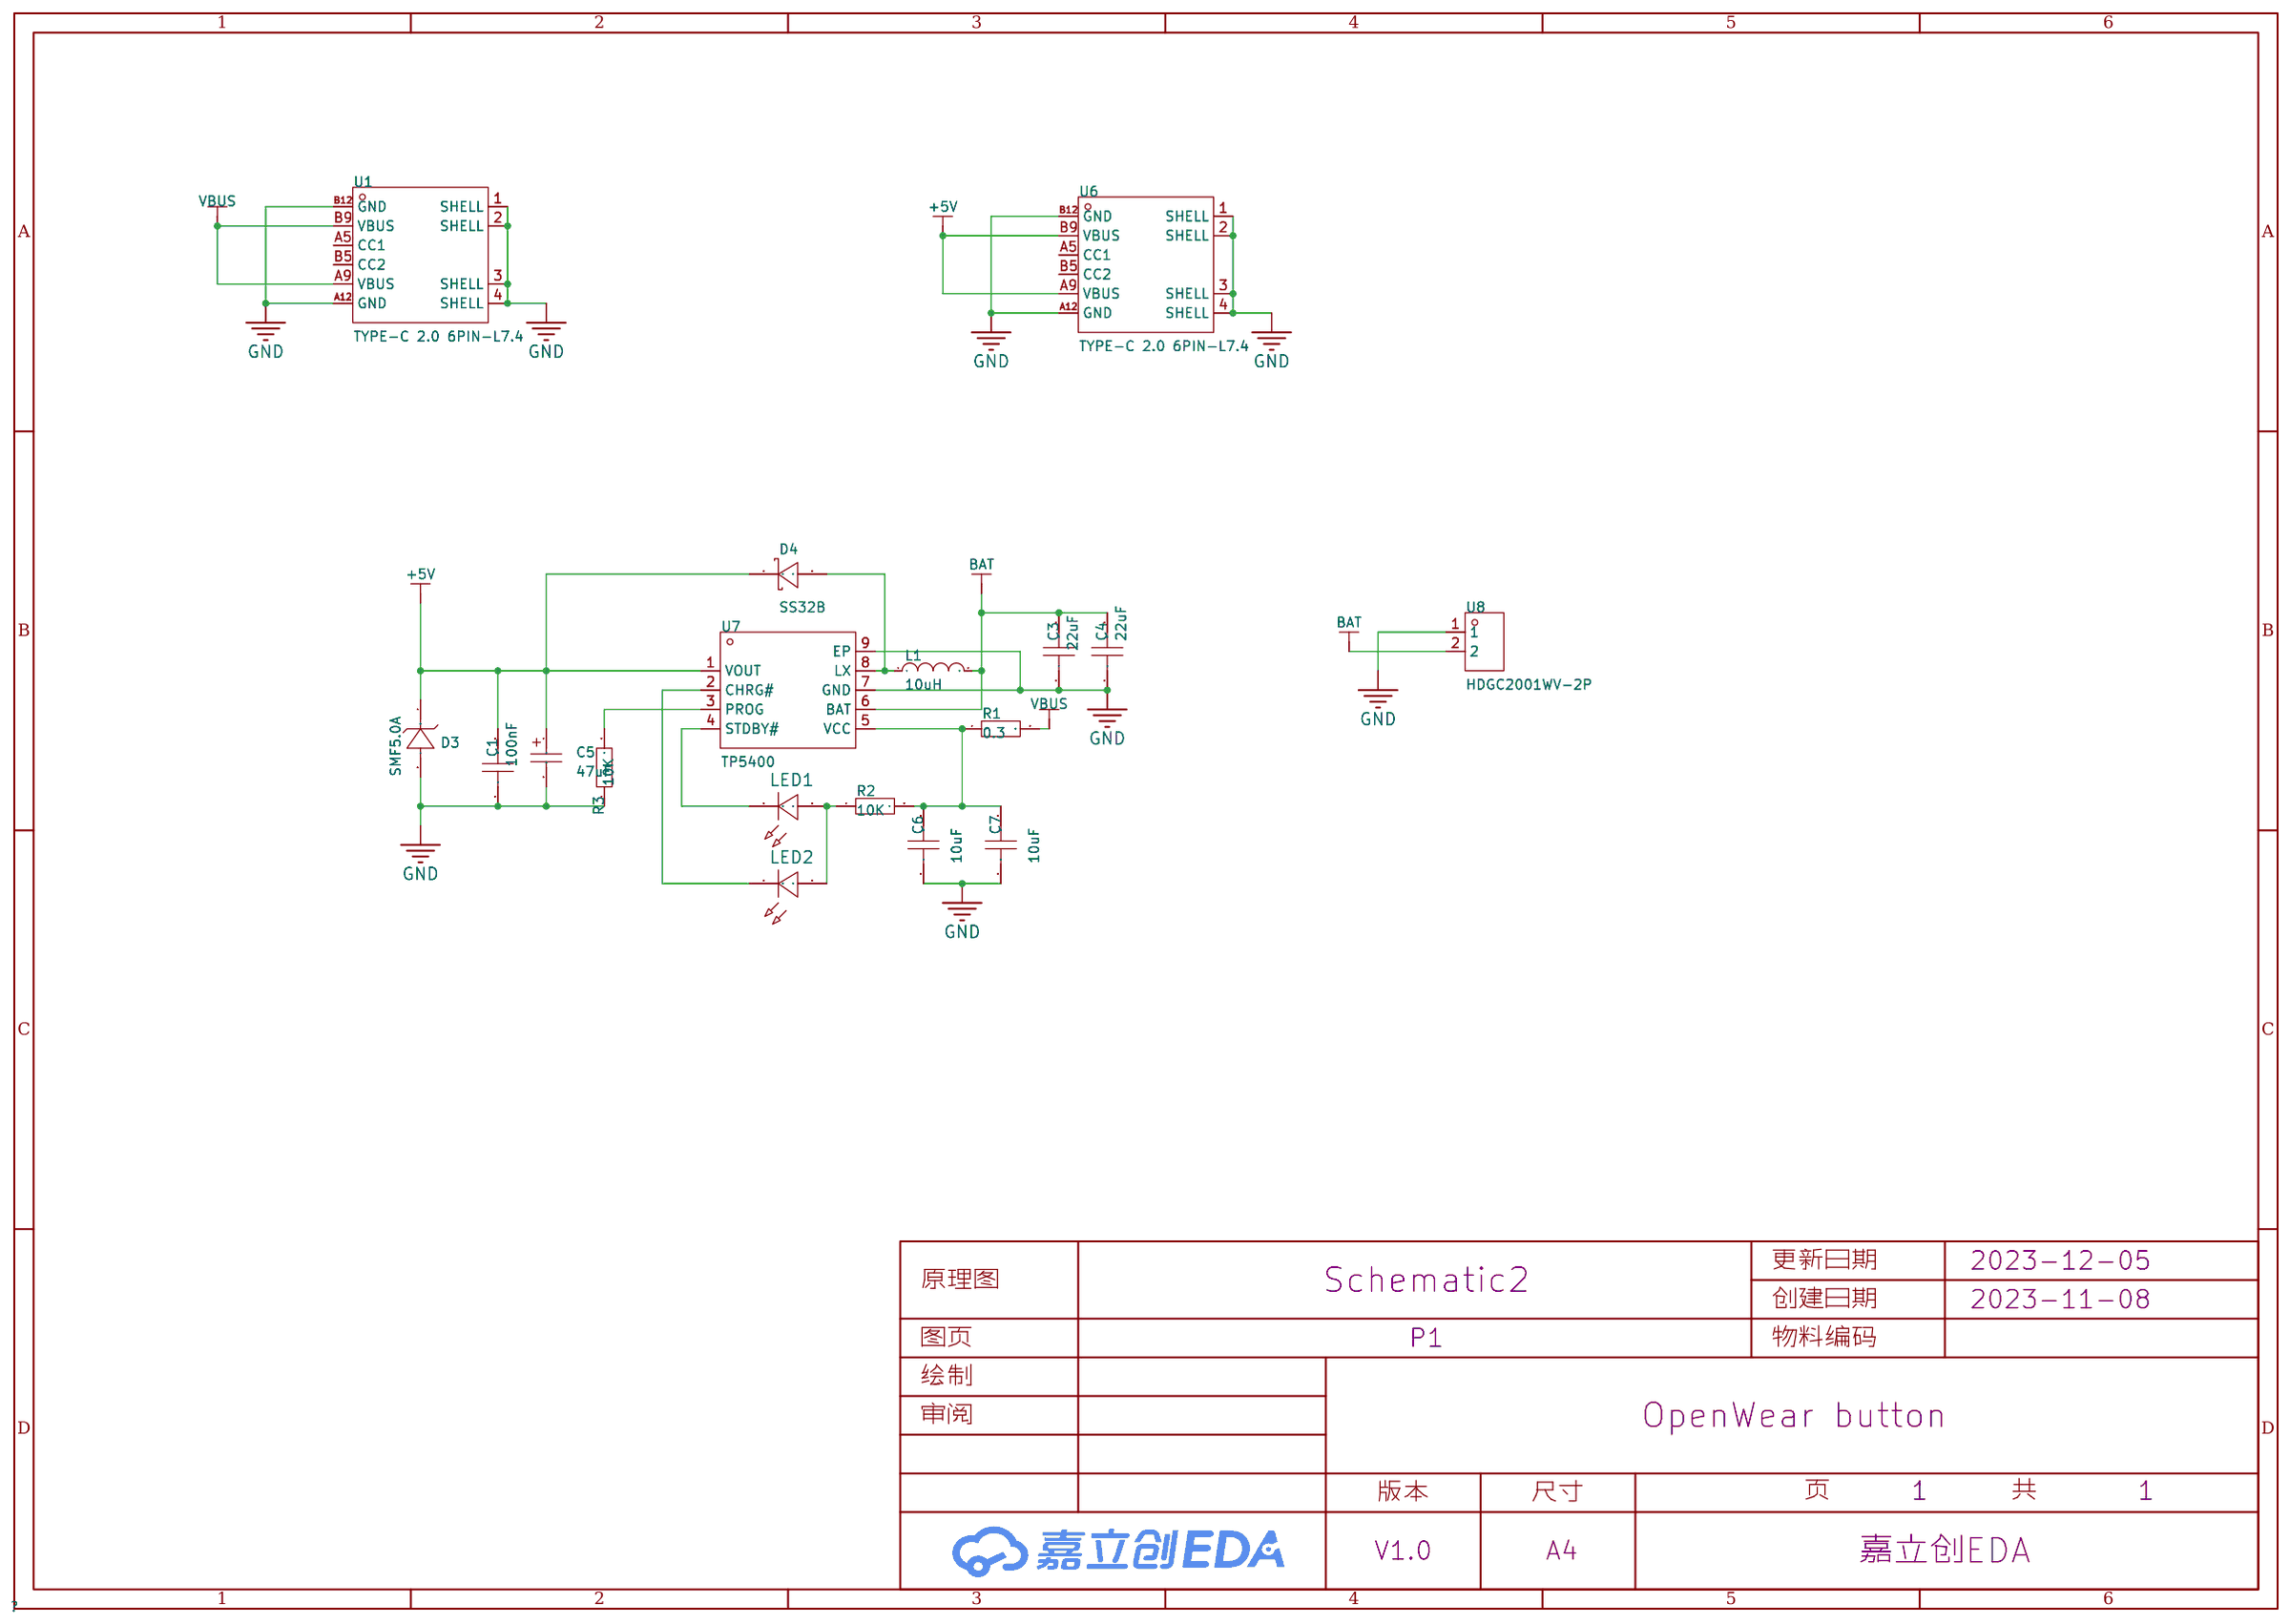
[diagram p5: schematic sheet]

## Parts
C1  100nF  [C0603]
C3  22uF  [C0603]
C4  22uF  [C0603]
C5  47uF  [CAP-SMD_L3.2-W1.6-RD-C7171]
C6  10uF  [C0603]
C7  10uF  [C0603]
D3  SMF5.0A  [SOD-123FL_L2.7-W1.8-LS3.8-RD]
D4  SS32B  [SMB_L4.4-W3.6-LS5.3-RD]
L1  10uH  [IND-SMD_L3.5-W3.0_SLF0302]
LED1  -  [LED_0603]
LED2  -  [LED_0603]
R1  0.3  [R0603]
R2  10K  [R0603]
R3  10K  [R0603]
U1  TYPE-C 2.0 6PIN-L7.4  [USB-C-SMD_TYPE-C2.06PIN-L7.4]
U6  TYPE-C 2.0 6PIN-L7.4  [USB-C-SMD_TYPE-C2.06PIN-L7.4]
U7  TP5400  [ESOP-8_L4.9-W3.9-P1.27-LS6.0-BL-EP]
U8  HDGC2001WV-2P  [CONN-TH_2P-P2.00_HDGC_HDGC2001WV-2P]

## Library data of the parts
C1 C3 C4 C6 C7 = CAP_0603: Supplier Footprint: 0603
C5 = TAJA106K016RNJ: 容值:10uF;精度:±10%;额定电压:16V;等效串联电阻:3Ω@100kHz;; LCSC Part Name: 10uF ±10% 16V; Supplier Part: C7171; Manufacturer: Kyocera AVX; Supplier Footprint: CASE-A-3216; Datasheet: https://atta.szlcsc.com/upload/public/pdf/source/20160107/1457707748093.pdf; Supplier: LCSC; Tolerance: ±10%; Rated Voltage: 16V; Equivalent Series Resistance(ESR): 3Ω@100kHz; Operating Temperature: -55℃~+125℃
D3 = SMF5.0A_C908213: 极性:单向;反向截止电压(Vrwm):5V;击穿电压(最小值):6.4V;击穿电压(最大值):7.25V;反向漏电流(Ir):800uA;峰值脉冲电流(Ipp)@10/1000μs:21.7A;最大钳位电压:9.2V;; LCSC Part Name: 单向 Vrwm:5V; Supplier Part: C908213; Manufacturer: FUXINSEMI(富芯森美); Supplier Footprint: SOD-123; JLCPCB Part Class: 扩展库; Datasheet: https://atta.szlcsc.com/upload/public/pdf/source/20201023/C908211_2B6F82B5D5E79B5CF282141215A9A141.pdf; Supplier: LCSC; Polarity: 单向; Reverse Stand-Off Voltage (Vrwm): 5V; Breakdown Voltage (Min): 6.4V; Breakdown Voltage (Max): 7.25V; Reverse Leakage Current (Ir): 800uA; Peak Pulse Current (Ipp)@10/1000μs: 21.7A; Maximum Clamping Voltage: 9.2V
D4 = SS32B: 直流反向耐压(Vr):20V;平均整流电流(Io):3A;正向压降(Vf):550mV@3A;; LCSC Part Name: 电压:20V 电流:3A; Supplier Part: C437986; Manufacturer: 晶导微电子; Supplier Footprint: SMB(DO-214AA); Datasheet: https://atta.szlcsc.com/upload/public/pdf/source/20191021/C437988_36857A8144C4C1C0145F77A17DE9F3B9.pdf; Supplier: LCSC; Reverse Voltage (Vr): 20V; Average Rectified Current (Io): 3A; Forward Voltage (Vf@If): 550mV@3A; Reverse Leakage Current (Ir): 350uA@20V; Peak forward surge current: 100A
L1 = CD32-100M: 类型:-;电感值:10uH;精度:±20%;额定电流:950mA;; LCSC Part Name: 10uH ±20%; Supplier Part: C2826622; Manufacturer: DMBJ(振宝佳); Supplier Footprint: SMD; Datasheet: https://atta.szlcsc.com/upload/public/pdf/source/20210416/C2826610_BD9EF4281FEC8102FBF66339CC69A197.pdf; Supplier: LCSC; Tolerance: ±20%; Rated Current: 950mA; DC Resistance (DCR): 286mΩ
LED1 LED2 = LED_0603-R: Supplier Footprint: 0603
R1-R3 = Res_0603: Supplier Footprint: 0603
U1 U6 = TYPE-C 2.0 6PIN-L7.4: Supplier Part: C9900021822; Supplier Footprint: USB-C-SMD_TYPE-C-6P; JLCPCB Part Class: 扩展库; Datasheet: https://atta.szlcsc.comnull; Supplier: LCSC
U7 = TP5400: Supplier Part: C2891434; Manufacturer: TOPPOWER(南京拓微); Supplier Footprint: ESOP-8; JLCPCB Part Class: 扩展库; Datasheet: https://atta.szlcsc.com/upload/public/pdf/source/20210909/352D9D40D77A1DD73F7904E364EF004B.pdf; Supplier: LCSC
U8 = HDGC2001WV-2P: LCSC Part Name: PH2.0直针 2P; Supplier Part: C5175230; Manufacturer: HDGC(华德共创); Supplier Footprint: 插件,P=2mm; Datasheet: https://atta.szlcsc.com/upload/public/pdf/source/20220916/C6875813FFA1039A4B3E585D63AEFA0D.pdf; Supplier: LCSC

## Nets
+5V: C1.2 C5.1 D3.1(C) D4.1(C) U6.A9(VBUS) U6.B9(VBUS) U7.1(VOUT)
GND: C1.1 C3.1 C4.1 C5.2 C6.1 C7.1 D3.2(A) R3.1 U1.1(SHELL) U1.2(SHELL) U1.3(SHELL) U1.4(SHELL) U1.A12(GND) U1.B12(GND) U6.1(SHELL) U6.2(SHELL) U6.3(SHELL) U6.4(SHELL) U6.A12(GND) U6.B12(GND) U7.7(GND) U7.9(EP) U8.1
VBUS: R1.2 U1.A9(VBUS) U1.B9(VBUS)
BAT: C3.2 C4.2 L1.2 U7.6(BAT) U8.2
$1N1470: LED1.2(A) LED2.2(A) R2.1
$1N1488: LED1.1(C) U7.4(STDBY#)
$1N1489: LED2.1(C) U7.2(CHRG#)
$1N1620: R3.2 U7.3(PROG)
$1N1941: D4.2(A) L1.1 U7.8(LX)
$1N4135: C6.2 C7.2 R1.1 R2.2 U7.5(VCC)

Not connected (* = marked no-connect by the designer): U1 A5(CC1) B5(CC2); U6 A5(CC1) B5(CC2)

# Schematic Schematic3
Create Date: 2023-11-28; Page Name: P1; Project Name: OpenWear button; Schematic Name: Schematic3; Update Date: 2023-11-28; Company: 嘉立创EDA; Page Size: A4; Version: V1.0
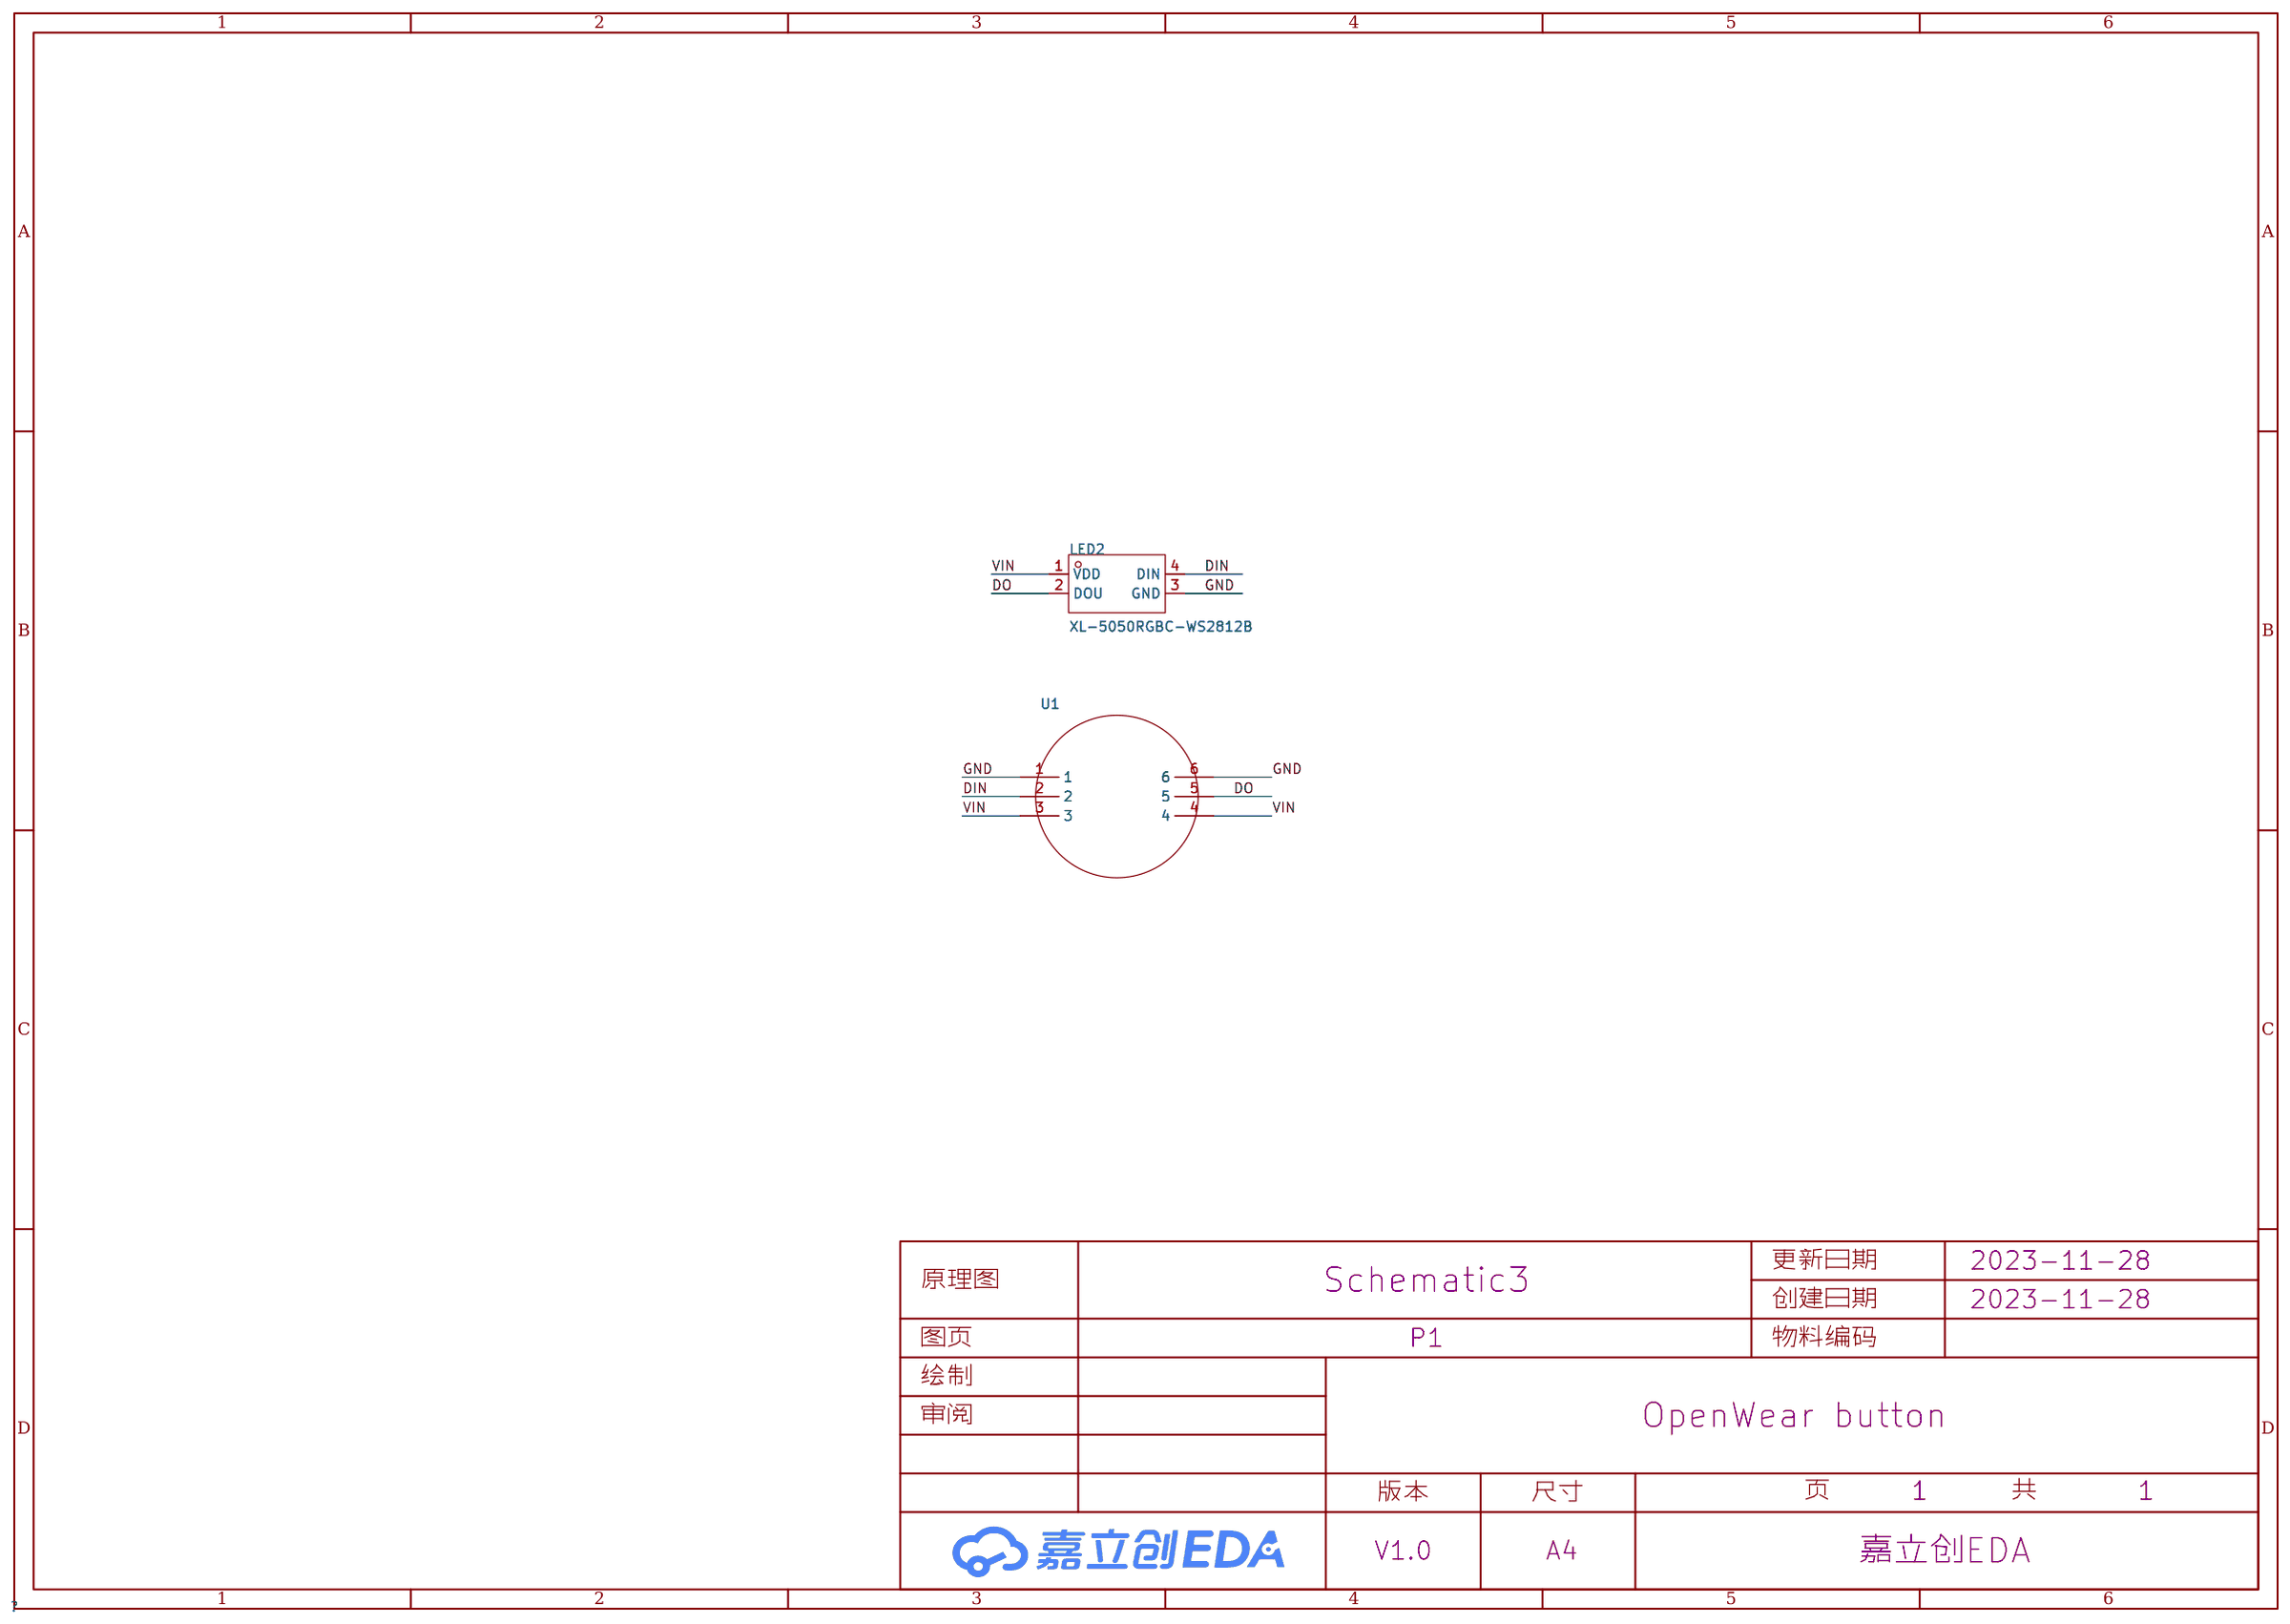
[diagram p6: schematic sheet]

## Parts
LED2  XL-5050RGBC-WS2812B  [LED-SMD_4P-L5.0-W5.0-BL_XL-5050RGBC]
U1  -  [ring-6]

## Library data of the parts
LED2 = XL-5050RGBC-WS2812B: 发光颜色:RGB三色;二极管配置:-;主波长:-;色温:-;功率:-;安装方式:正贴;; LCSC Part Name: RGB三色 正贴 幻彩; Supplier Part: C2843785; Manufacturer: XINGLIGHT(成兴光); Supplier Footprint: SMD5050; JLCPCB Part Class: 扩展库; Datasheet: https://atta.szlcsc.com/upload/public/pdf/source/20230111/86AAD2096485A2E5BCAB883FF8CBE6FD.pdf; Supplier: LCSC; Emitted Color: RGB三色; Lens Color: 无色透明; Peak Wavelength: 625nm；470nm；530nm; Viewing Angle: 120°; Mounting Sytle: 正贴; Operating Temperature: -30℃~+70℃
U1 = ring-6

## Nets
GND: LED2.3(GND) U1.1 U1.6
VIN: LED2.1(VDD) U1.3 U1.4
DIN: LED2.4(DIN) U1.2
DO: LED2.2(DOU) U1.5

# Schematic Schematic4
Create Date: 2023-11-28; Page Name: P1; Project Name: OpenWear button; Schematic Name: Schematic4; Update Date: 2023-11-28; Company: 嘉立创EDA; Page Size: A4; Version: V1.0
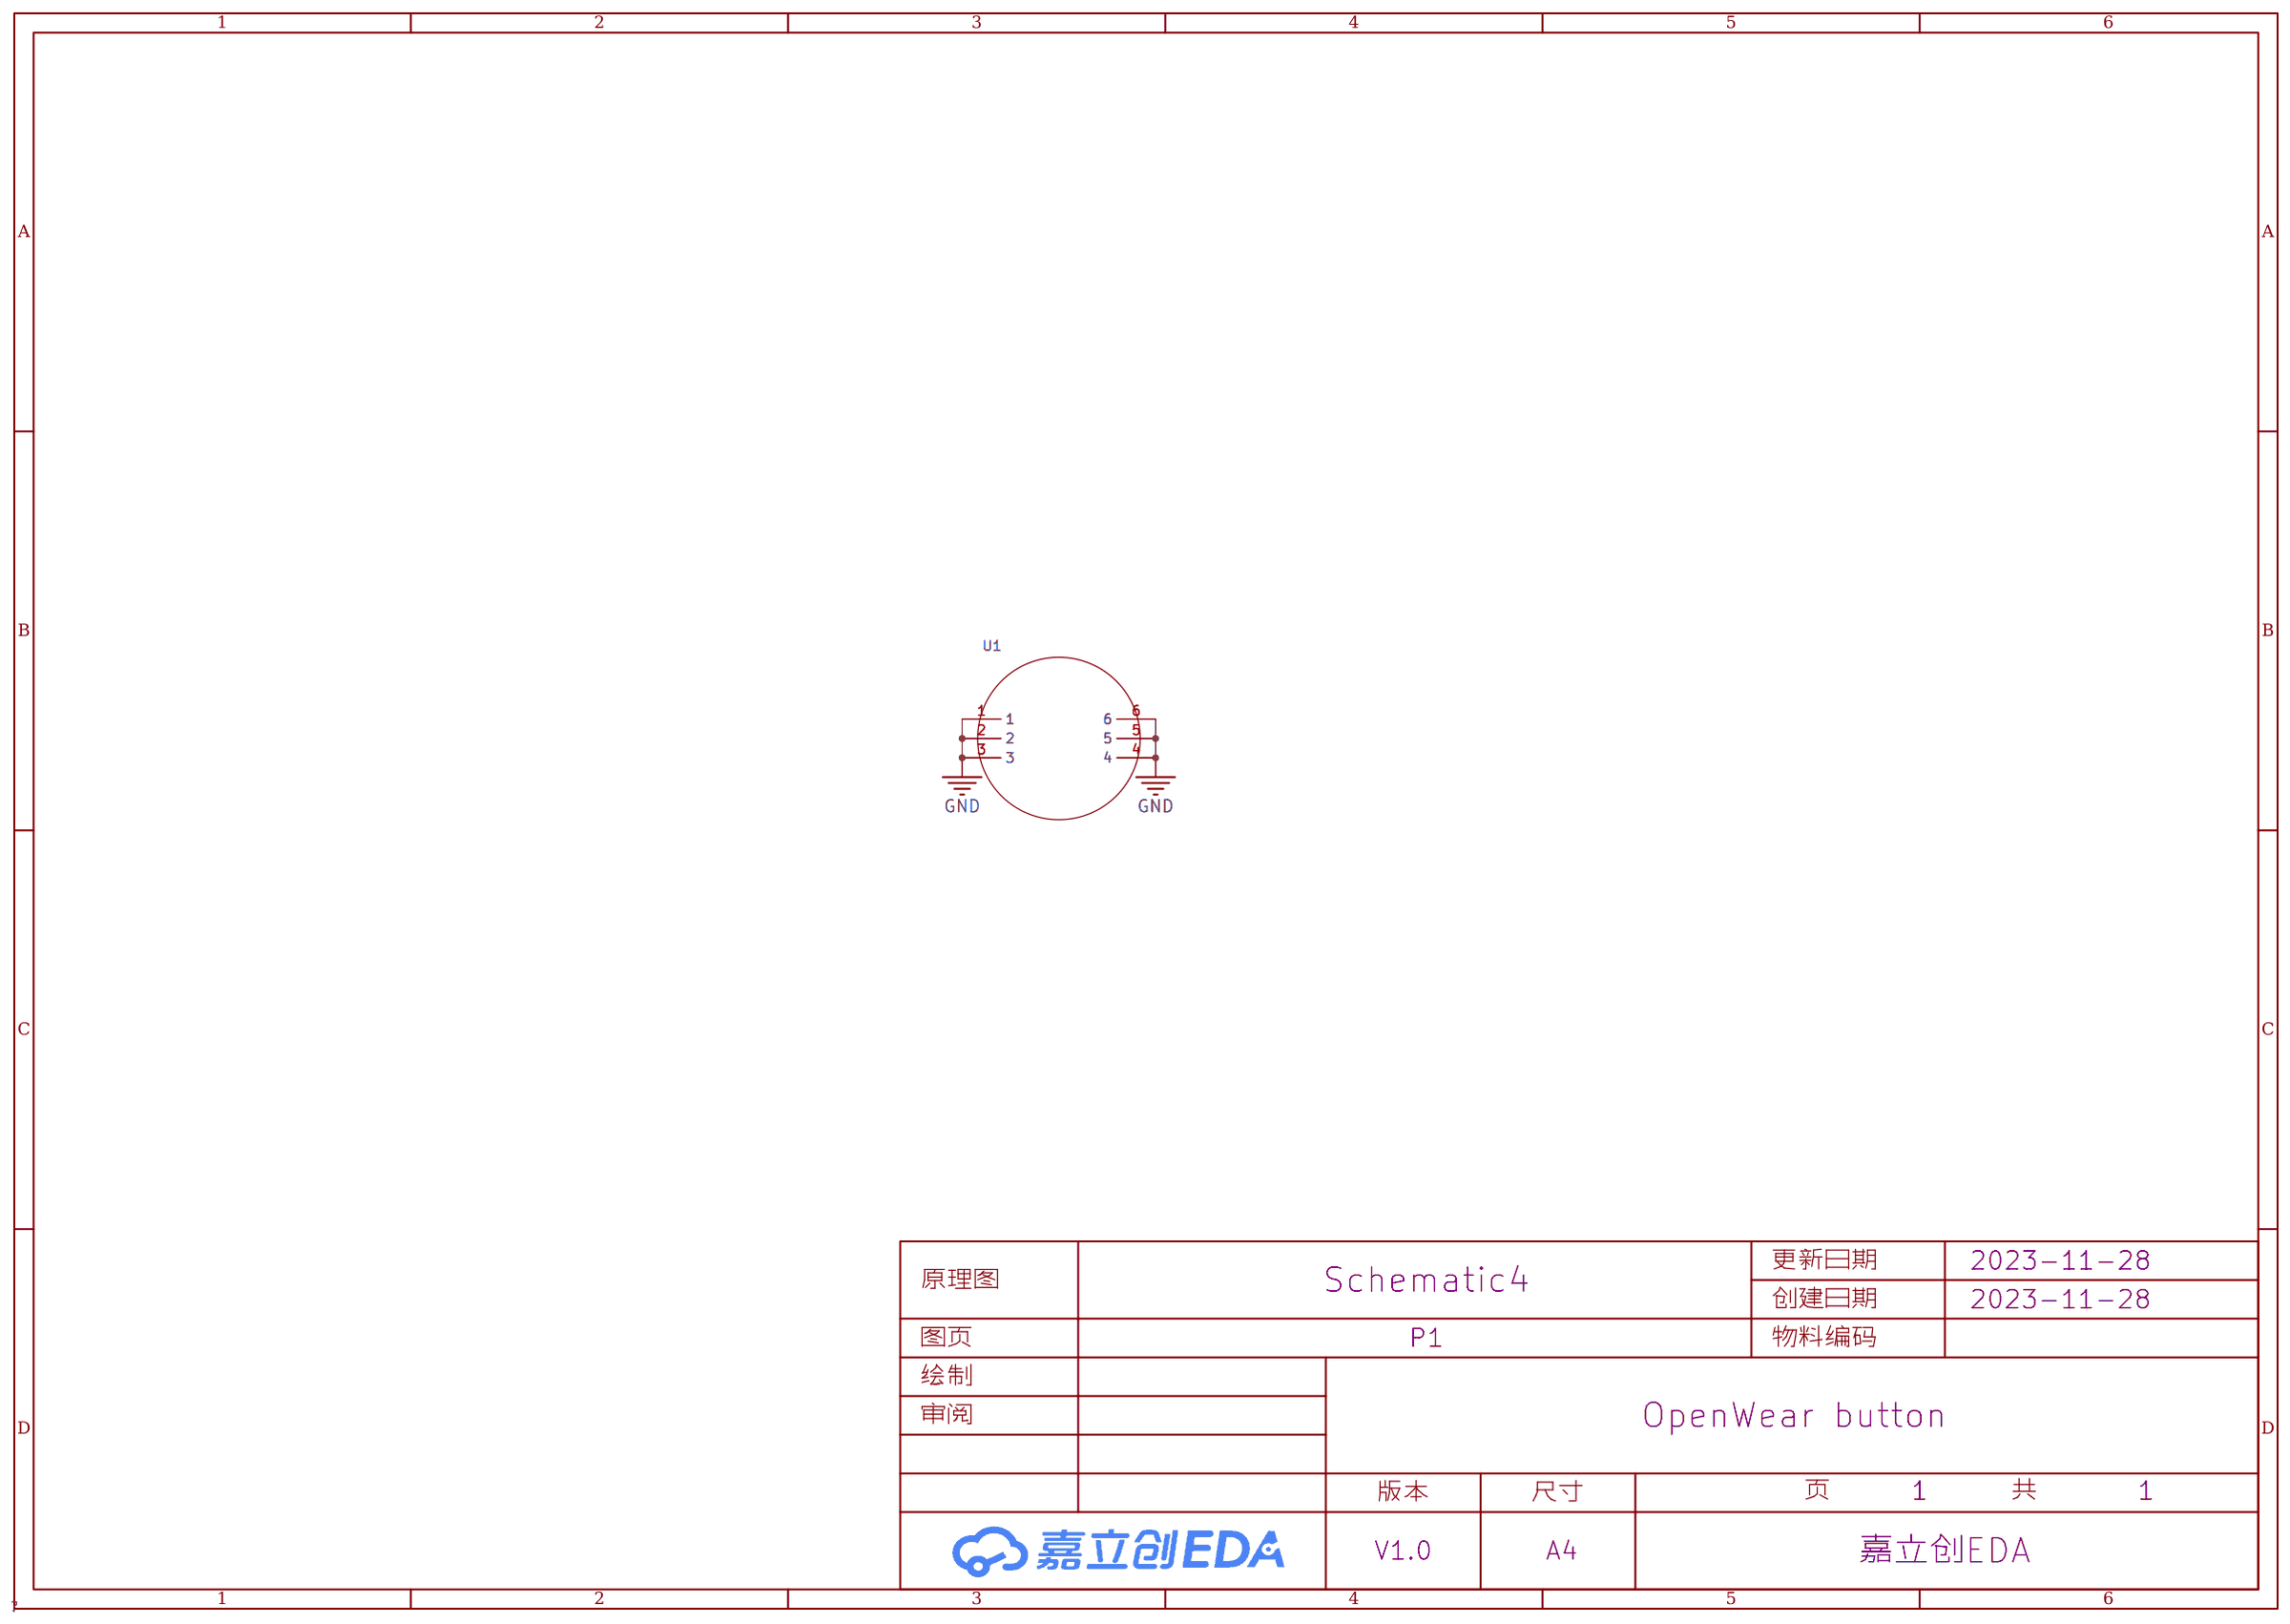
[diagram p7: schematic sheet]

## Parts
U1  -  [ring-6]

## Library data of the parts
U1 = ring-6

## Nets
GND: U1.1 U1.2 U1.3 U1.4 U1.5 U1.6

# Schematic Schematic5
Create Date: 2023-11-28; Page Name: P1; Project Name: OpenWear button; Schematic Name: Schematic5; Update Date: 2023-11-28; Company: 嘉立创EDA; Page Size: A4; Version: V1.0
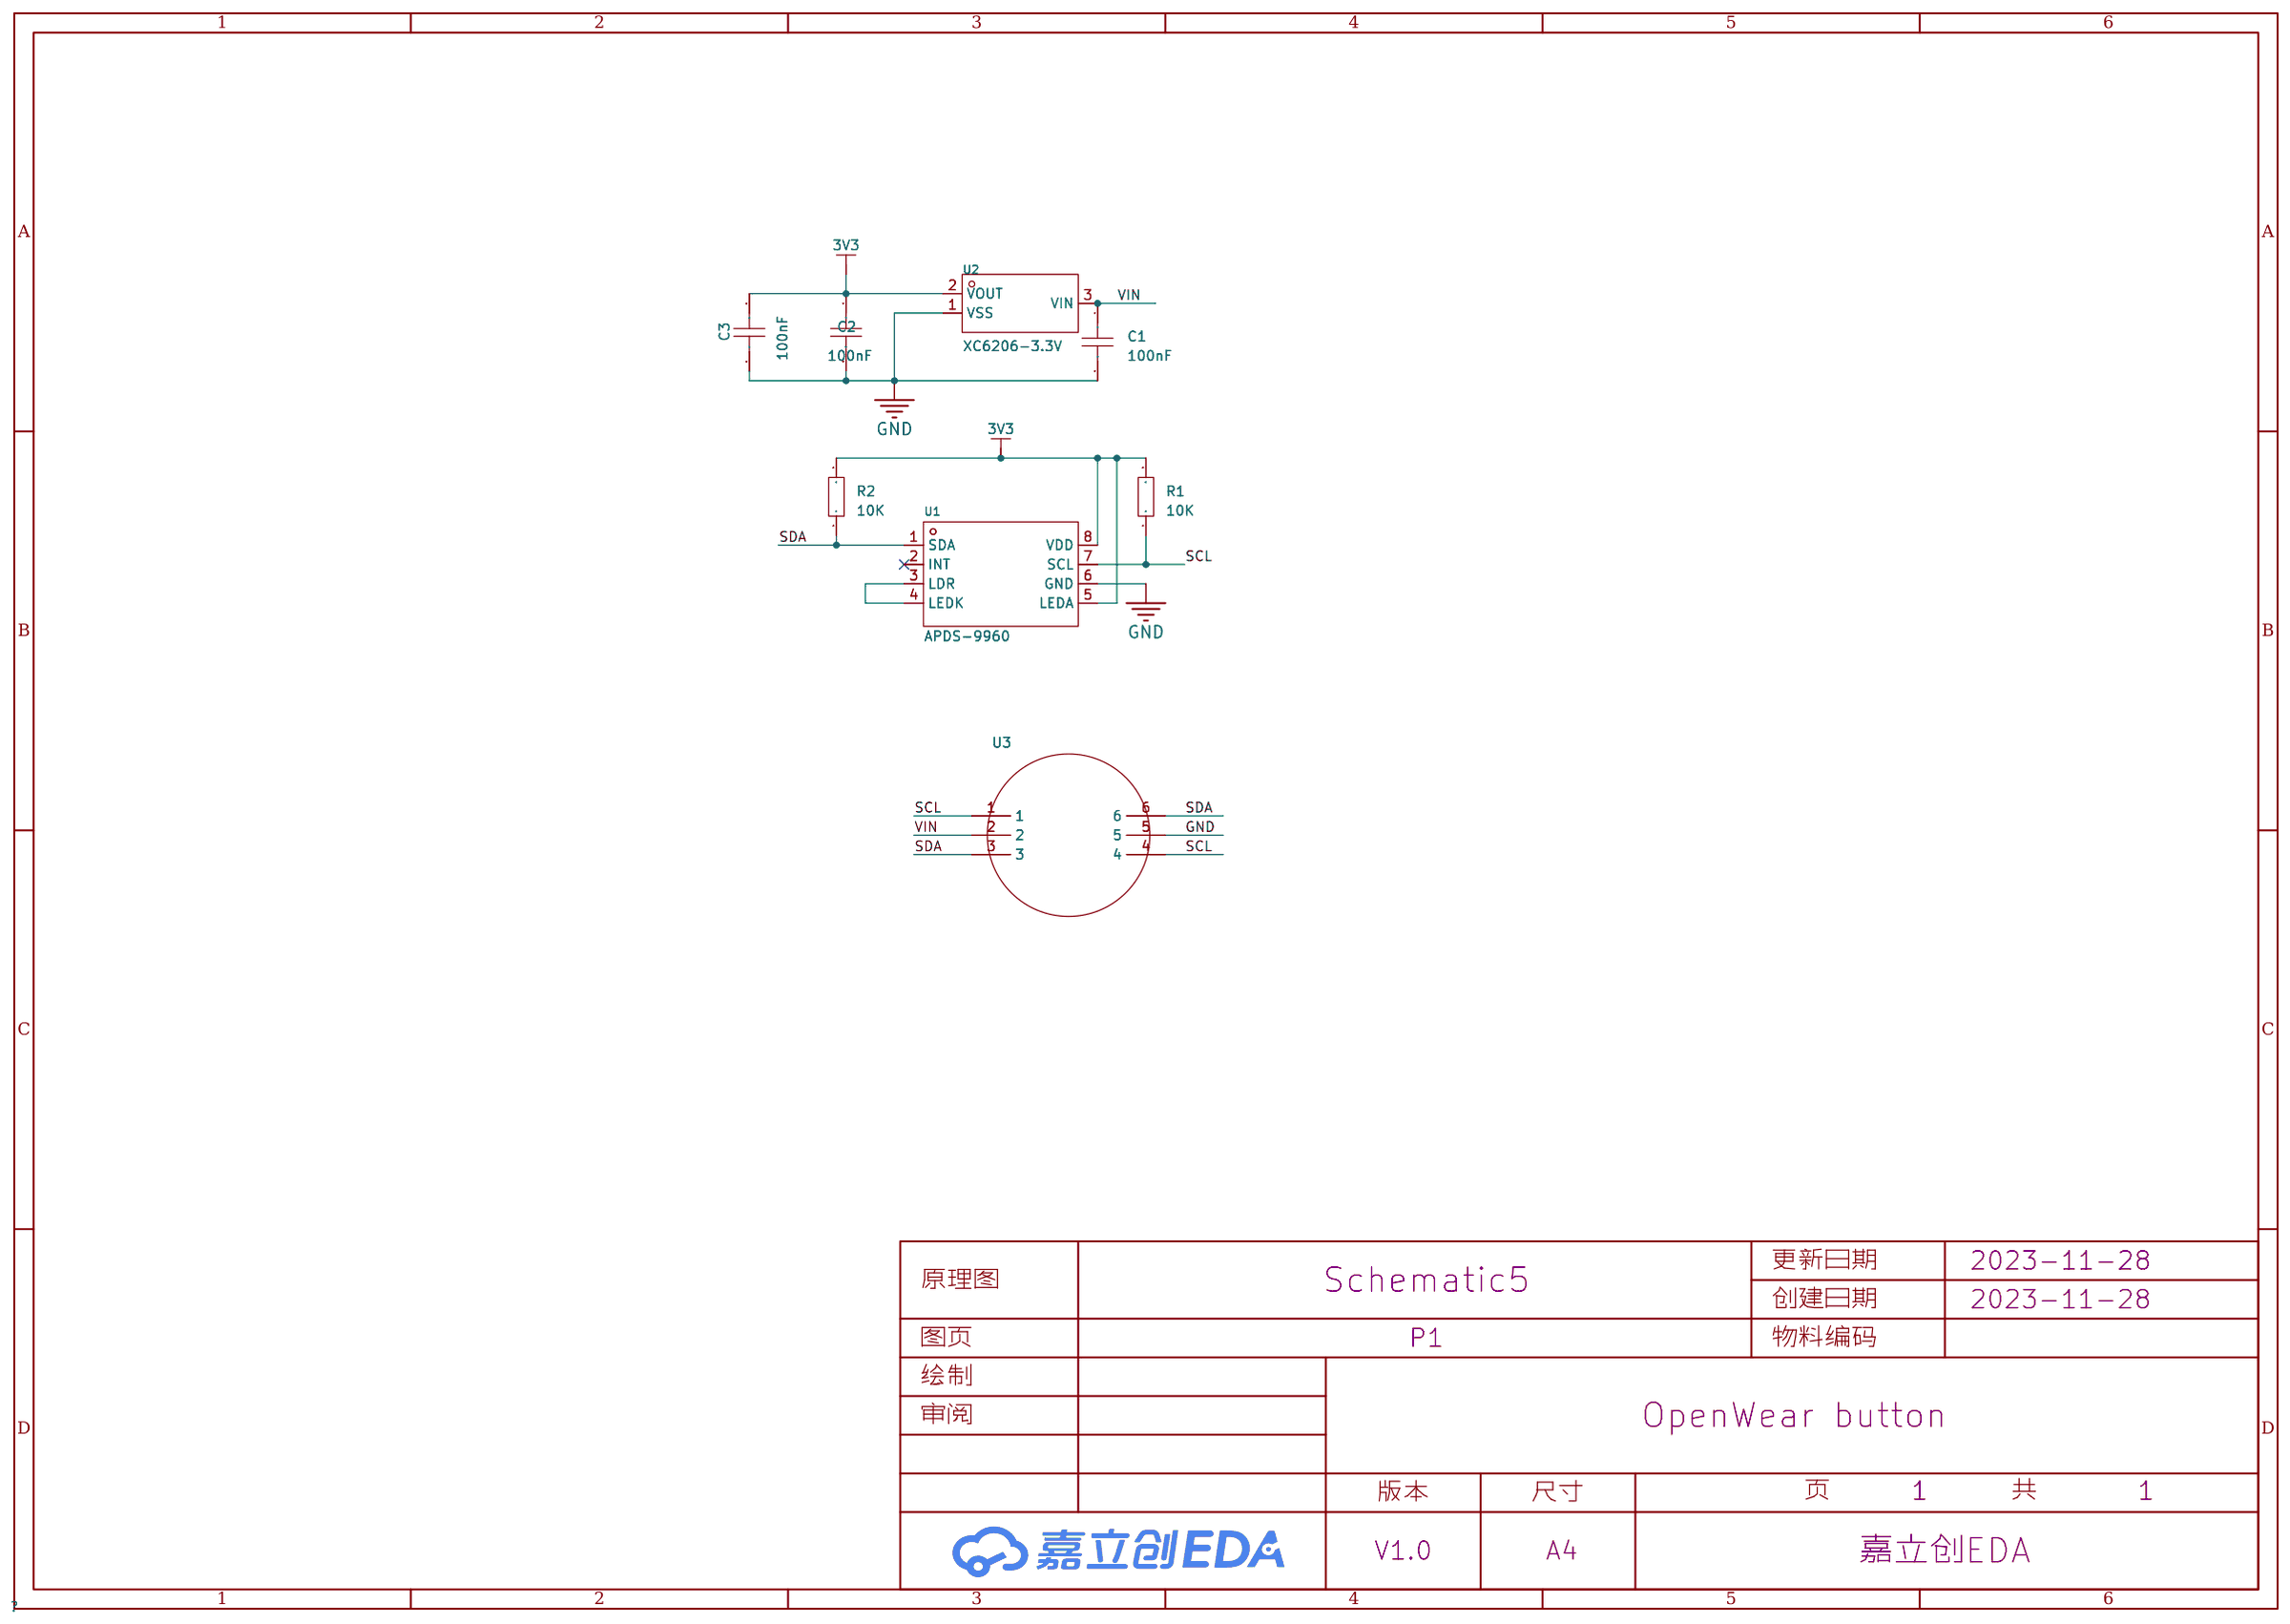
[diagram p8: schematic sheet]

## Parts
C1  100nF  [C0603]
C2  100nF  [C0603]
C3  100nF  [C0603]
R1  10K  [R0603]
R2  10K  [R0603]
U1  APDS-9960  [SENSORS-SMD_APDS-9960]
U2  XC6206-3.3V  [SOT-23-3_L2.9-W1.3-P0.95-LS2.4-BR]
U3  -  [ring-6]

## Library data of the parts
C1-C3 = 0603B104K500NT: 容值:100nF;精度:±10%;额定电压:50V;材质(温度系数):X7R;; LCSC Part Name: 100nF ±10% 50V; Supplier Part: C30926; Manufacturer: FH(风华); Supplier Footprint: 0603; JLCPCB Part Class: Extended Part; Datasheet: https://atta.szlcsc.com/upload/public/pdf/source/20170923/C30926_1506149436298988724.pdf; Supplier: LCSC; Tolerance: ±10%; Voltage Rated: 50V; Temperature Coefficient: X7R
R1 R2 = Res_0603: Supplier Footprint: 0603
U1 = APDS-9960: 数字 RGB、环境光、近程和手势传感器; Supplier Part: C93222; Manufacturer: Broadcom/AVAGO(安华高); Supplier Footprint: SMD-8P; Datasheet: https://atta.szlcsc.com/upload/public/pdf/source/20171113/C93222_15105616742161116170.pdf; Supplier: LCSC
U2 = XC6206-3.3V_C7603199: 输出类型:固定;输出极性:正;最大输入电压:6V;输出电压:3.3V;输出电流:250mA;电源纹波抑制比(PSRR):-;; Supplier Part: C7603199; Manufacturer: KUU; Supplier Footprint: SOT-23; Datasheet: https://atta.szlcsc.com/upload/public/pdf/source/20230906/3CE080927AAB6AA2CDC05E5D25A8DE02.pdf; Supplier: LCSC; Output Type: 固定; Output Polarity: 正; Number of Outputs: 1; Maximum Input Voltage: 6V; Output Voltage: 3.3V; Output Current: 250mA; Operating Temperature: -25℃~+125℃@(Tj)
U3 = ring-6

## Nets
3V3: C2.1 C3.1 R1.2 R2.2 U1.5(LEDA) U1.8(VDD) U2.2(VOUT)
GND: C1.2 C2.2 C3.2 U1.6(GND) U2.1(VSS) U3.5
VIN: C1.1 U2.3(VIN) U3.2
SCL: R1.1 U1.7(SCL) U3.1 U3.4
SDA: R2.1 U1.1(SDA) U3.3 U3.6
$1N308: U1.3(LDR) U1.4(LEDK)

Not connected (* = marked no-connect by the designer): U1 2(INT)*

# Schematic schematic1_6
Create Date: 2024-08-06; Page Name: P1; Project Name: OpenWear Module; Schematic Name: schematic1_6; Update Date: 2024-08-06
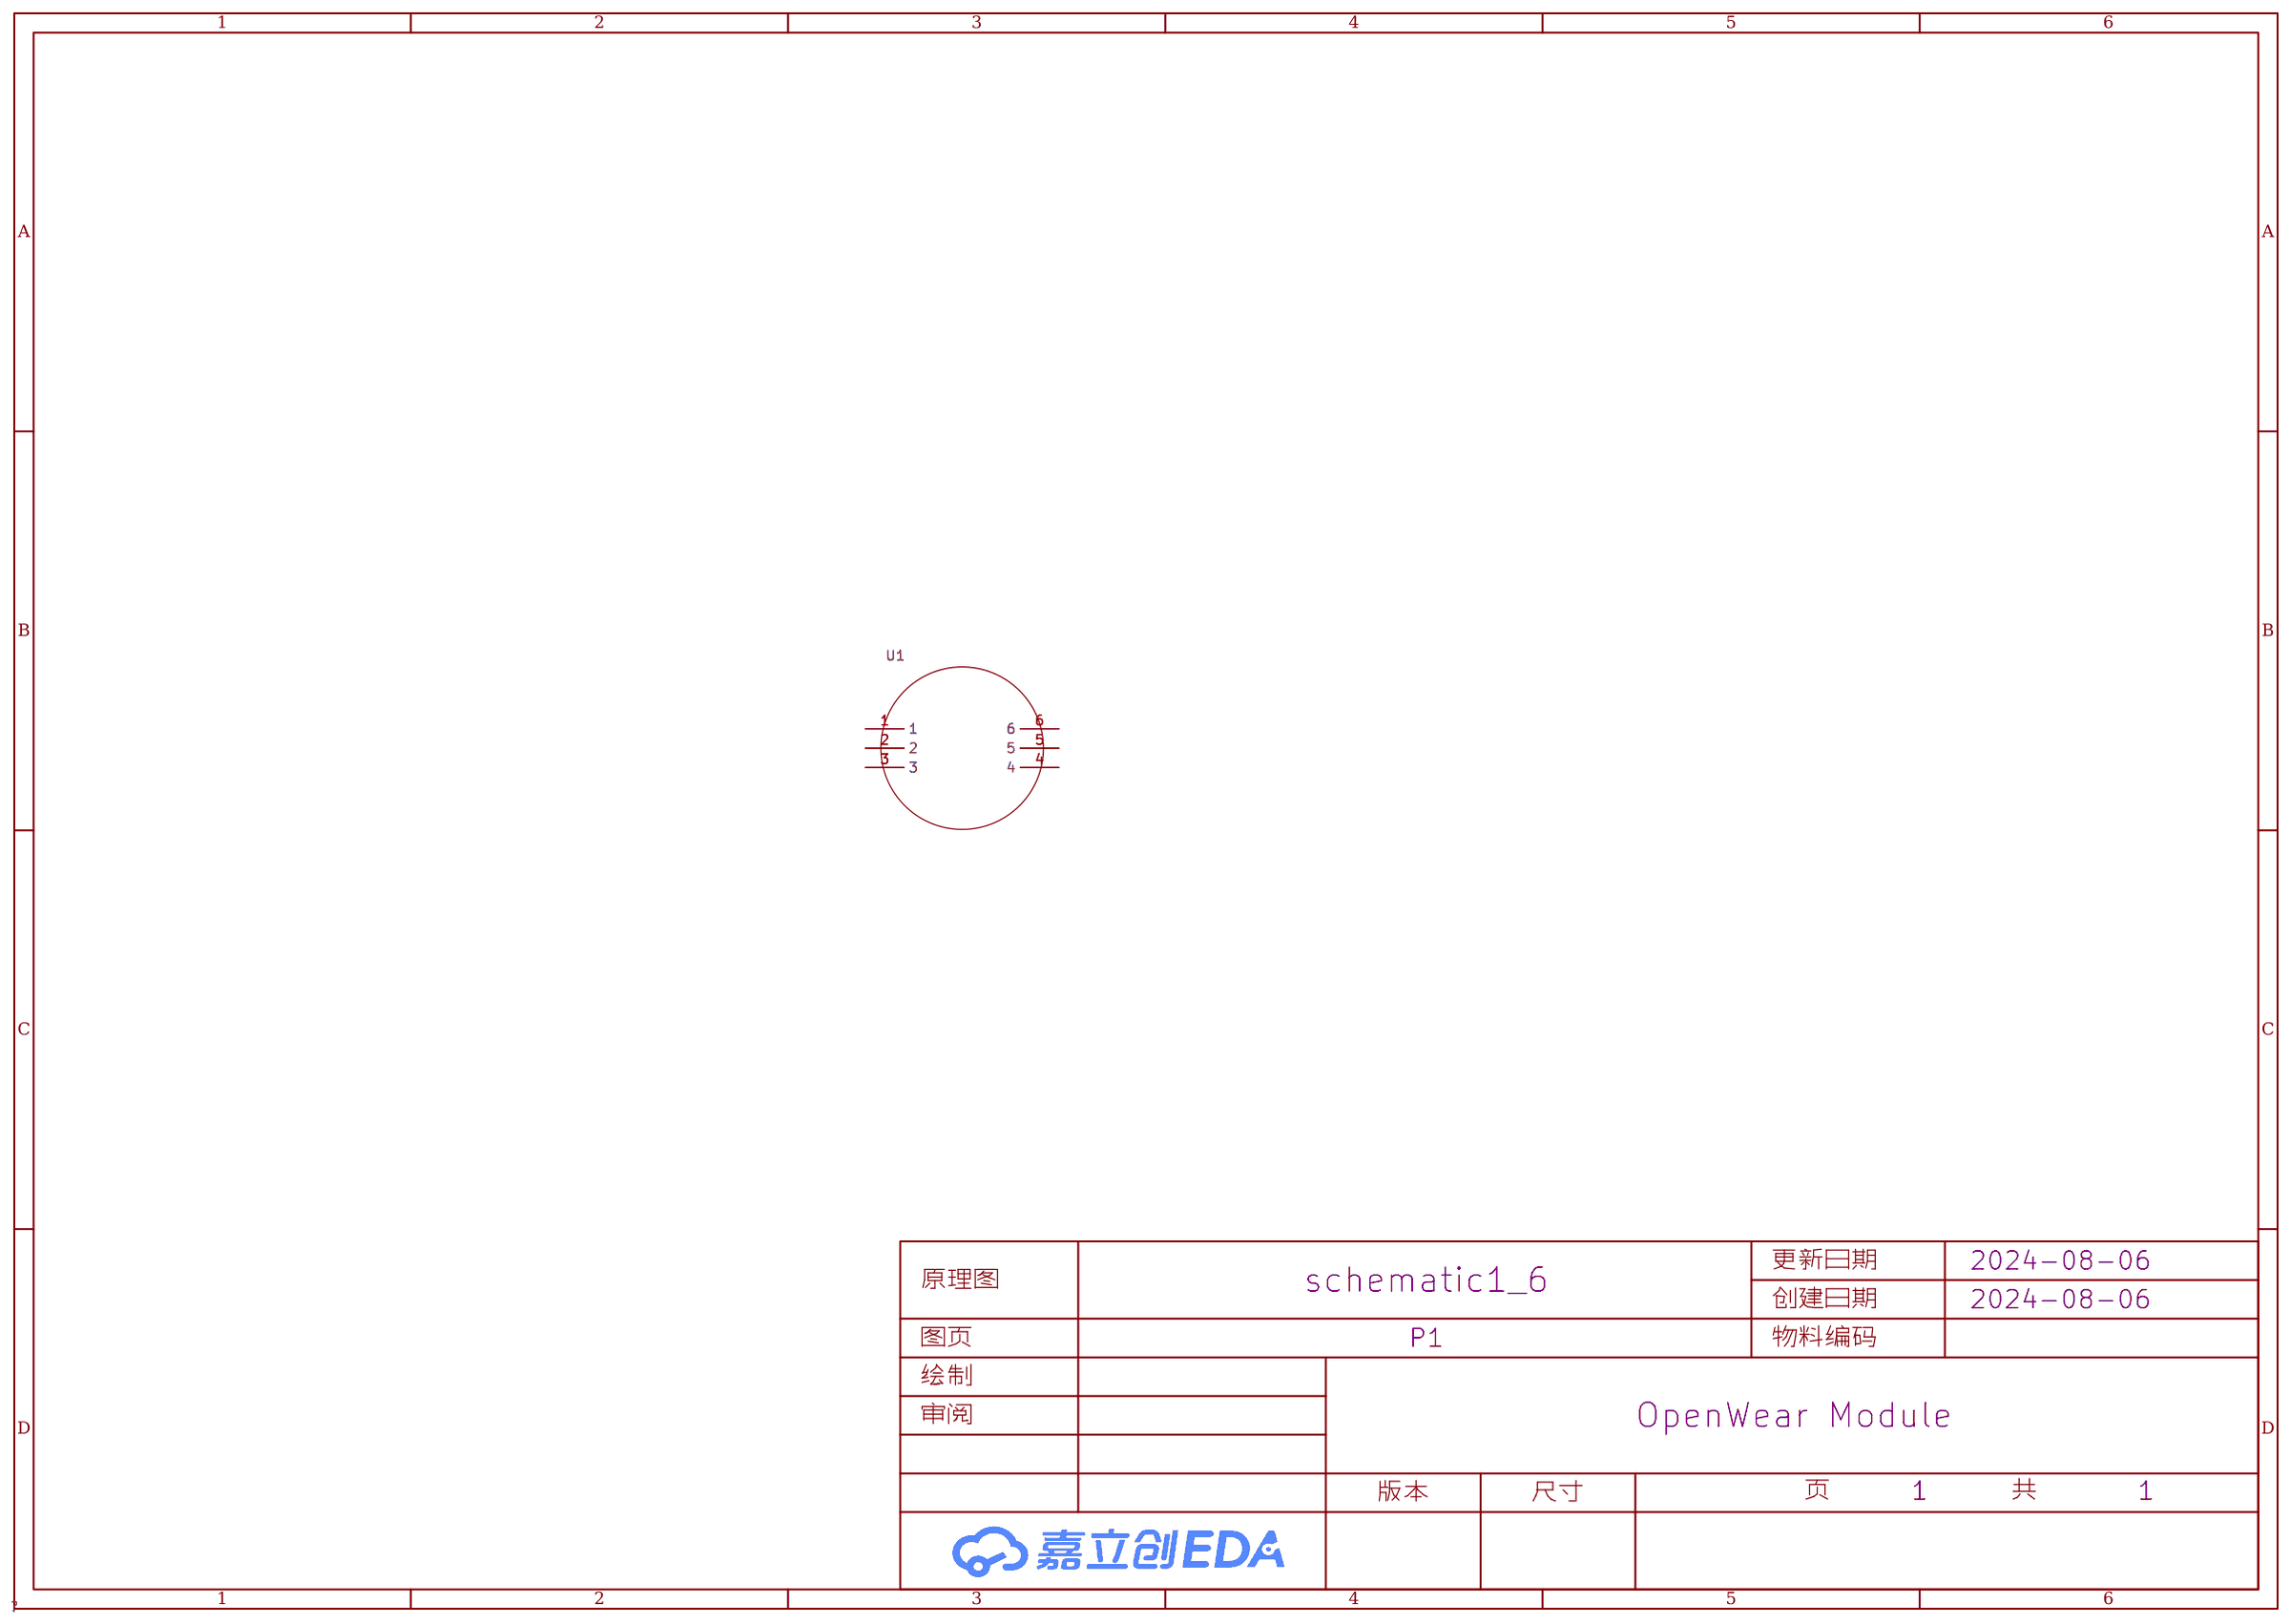
[diagram p9: schematic sheet]

## Parts
U1  -  [ring-6]

## Library data of the parts
U1 = ring-6

## Nets

Not connected (* = marked no-connect by the designer): U1 1 2 3 4 5 6

# Board PCB6
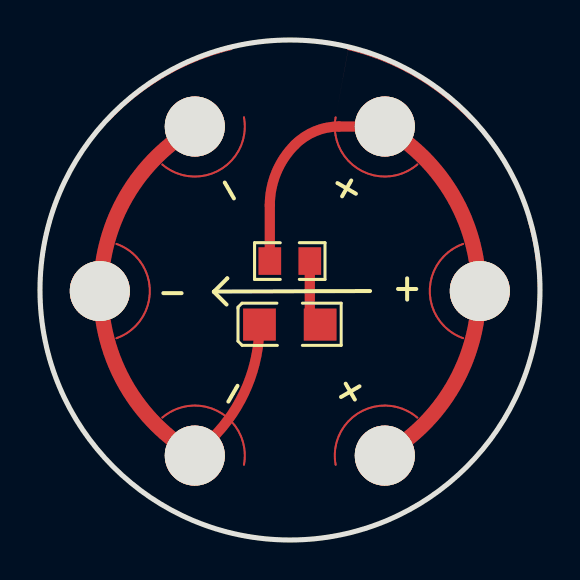
[diagram p10: board, top side]
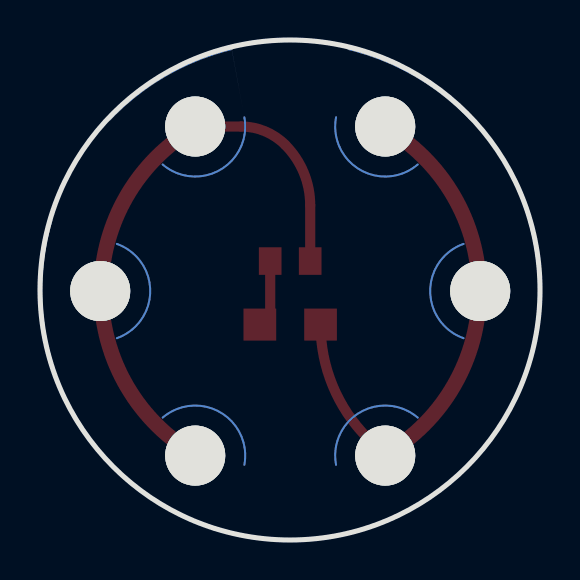
[diagram p11: board, bottom side, seen from below]

Outline 25 x 25 mm; copper layers: Top Layer, Inner1, Inner2, Inner3, Inner4, Inner5, Inner6, Inner7, Inner8, Inner9, Inner10, Inner11, Inner12, Inner13, Inner14, Inner15, Inner16, Inner17, Inner18, Inner19, Inner20, Inner21, Inner22, Inner23, Inner24, Inner25, Inner26, Inner27, Inner28, Inner29, Inner30, Bottom Layer. Coordinates in mm from the lower left corner of the outline.
Outline path: circle c12.5,12.5 r12.5
Stack: Top Layer 0.035mm / Dielectric1 1.51mm FR4 er 4.5 / Bottom Layer 0.035mm

## Design rules (mm)
template: JLCPCB Capability(Two Layers Board)
spacing copperThickness1oz (default): track to track 0.102, other pairs 0.152 to 0.3
spacing copperThickness2oz: track to track 0.203, other pairs 0.152 to 0.3
track width copperThickness1oz (default): min 0.127, default 0.254, max 2.54
track width copperThickness2oz: min 0.203, default 0.254, max 2.54
differential pair differentialPair (default): width min 0.127, default 0.254, max 2.54; gap min 0.152, default 0.152
via viaSize (default): diameter min 0.5, default 0.61, max 10; hole min 0.3, default 0.305, max 6.3

## Placement (name value [footprint] x y rotation side)
LED1  SZYY1206B  [LED1206-RD_BLUE]  12.49 10.77 0 top
R1  10K  [R0805]  12.49 13.95 180 top
U1  -  [ring-6]  12.49 12.45 0 top

## Footprints (pads in the part's own frame, mm; a bottom-side part is the same pattern mirrored in y, then rotated)
LED1206-RD_BLUE
  rect 1.635x1.6 smd: 1(-1.518,0) 2(1.518,0)
R0805
  rect 1.133x1.377 smd: 1(-1,0) 2(1,0)
ring-6
  custom 6.768x6.375 hole 0.003: 1(-5.634,8.495)
  round 3 hole 3: 1(-4.75,8.227) 2(-9.5,0) 3(-4.75,-8.227) 4(4.75,-8.227) 5(9.5,0) 6(4.75,8.227)
  custom 5.45x7.031 hole 0.003: 2(-9.725,0) 5(9.725,0)
  custom 6.766x6.375 hole 0.003: 3(-5.633,-8.495)
  custom 6.766x6.374 hole 0.003: 4(5.633,-8.495) 6(5.633,8.495)

## Nets
As in the schematic.

## Routing (per net, layer and track width the routed paths; a pad name or vN(x,y) marks a point on that pad's centre or on a via; arc(x,y) is an arc through that point)
$1N188: length 3.4
  Top Layer w0.508: R1.1 13.49,11.29 LED1.2
$1N621: length 27.4
  Top Layer w0.508: U1.3 8.63,5.11 arc(10.36,7.71) LED1.1
  Top Layer w0.762: 7.78,4.25 arc(3.04,12.48) 7.84,20.68
$1N631: length 30.8
  Top Layer w0.508: R1.2 11.49,16.74 arc(11.82,18.37) 12.74,19.76 arc(13.75,20.44) 14.95,20.67 U1.6
  Top Layer w0.762: 17.2,20.64 arc(21.94,12.41) 17.14,4.22

## Text on the board
Top Silkscreen Layer: + | -
